# Altium project FLEXI_HAL_Quark_Mezz.PrjPCB
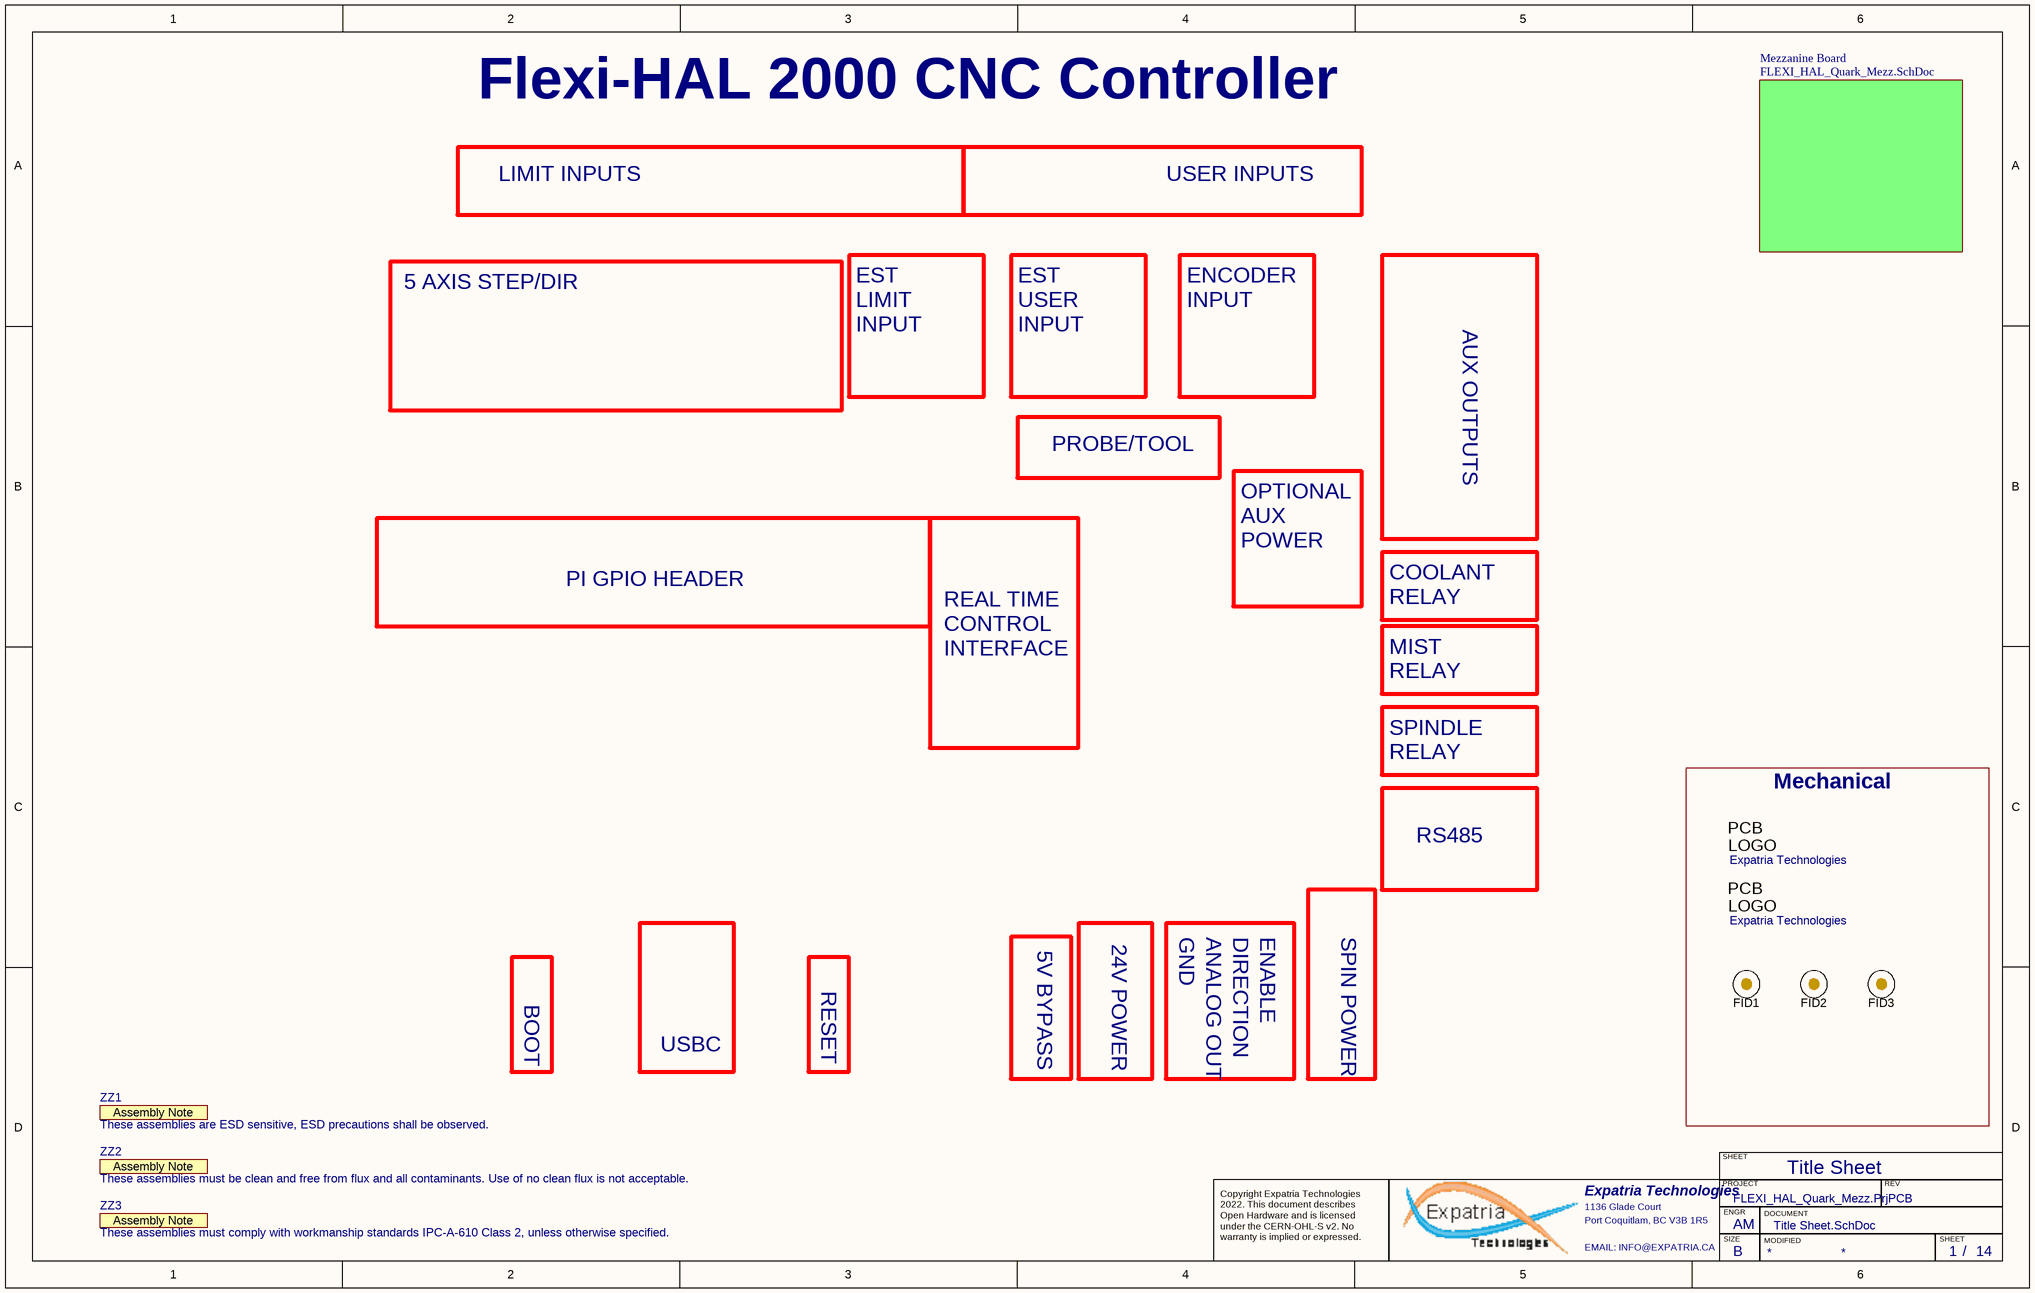
[diagram p0: Title Sheet.SchDoc]
PCBPARTNO: FlexiHAL-STP; PCBREVNO: A1; Title: FlexiHAL-STP; VarRevNo: A1
9 sheets, 138 parts. Net scope: hierarchical (ports join the sheet entries above them; power ports are global).
Board file: FLEXI_HAL_Quark_Mezz.pcbdoc
Sheets:
  Title Sheet.SchDoc
    Mezzanine Board = FLEXI_HAL_Quark_Mezz.SchDoc
      LIM_SW = Limit_Switches.SchDoc
        XL = Photocoupler12Vinput.SchDoc
        YL = Photocoupler12Vinput.SchDoc
        ZL = Photocoupler12Vinput.SchDoc
        AL = Photocoupler12Vinput.SchDoc
        BL = Photocoupler12Vinput.SchDoc
        CL = Photocoupler12Vinput.SchDoc
      USR_SW = Misc_switches.SchDoc
        UD = Photocoupler12Vinput.SchDoc
        UP = Photocoupler12Vinput.SchDoc
        UR = Photocoupler12Vinput.SchDoc
        UH = Photocoupler12Vinput.SchDoc
        UT = Photocoupler12Vinput.SchDoc
      SPINDLE = Spindle_Control.SchDoc
      AUX_O = Aux_Outputs.SchDoc
        RL = Relay_Driver.SchDoc
        RL = Relay_Driver.SchDoc
        RL = Relay_Driver.SchDoc
        RL = Relay_Driver.SchDoc
        RL = Relay_Driver.SchDoc
        RL = Relay_Driver.SchDoc
      AUX_I = Aux_Inputs.SchDoc

## Sheet Title Sheet.SchDoc: STM32F446 CNC
size B; Author: AM; CompanyName: Expatria Technologies; DrawnBy: A.Marles; Engineer: AM; Organization: Expatria Technolgoies; DocumentNumber: 1; Revision: A1; SheetNumber: 1; SheetTotal: 14

### Parts
FID1  Fiducial  [Fiducial10-20]  (value not drawn)  (no BOM)
FID2  Fiducial  [Fiducial10-20]  (value not drawn)  (no BOM)
FID3  Fiducial  [Fiducial10-20]  (value not drawn)  (no BOM)
Logo1  Expatria Technologies  [Expatria-Logo]  (no BOM)
Logo2  Expatria Technologies  [Expatria-Logo]  (no BOM)
ZZ1  These assemblies are ESD sensitive, ESD precautions shall be observed.  [AssemblyNote]  (graphical)
ZZ2  These assemblies must be clean and free from flux and all contaminants. Use of no clean flux is not acceptable.  [AssemblyNote]  (graphical)
ZZ3  These assemblies must comply with workmanship standards IPC-A-610 Class 2, unless otherwise specified.  [AssemblyNote]  (graphical)

### Blocks framed on the sheet
Mechanical: FID1-FID3 Logo1 Logo2

### Sub-sheets
Mezzanine Board = FLEXI_HAL_Quark_Mezz.SchDoc: no entries

### Notes on the sheet
- Flexi-HAL 2000 CNC Controller
- LIMIT INPUTS
- USER INPUTS
- 5 AXIS STEP/DIR
- EST
  LIMIT
  INPUT
- EST
  USER
  INPUT
- ENCODER
  INPUT
- AUX OUTPUTS
- PROBE/TOOL
- OPTIONAL
  AUX
  POWER
- PI GPIO HEADER
- COOLANT
  RELAY
- MIST
  RELAY
- SPINDLE
  RELAY
- REAL TIME CONTROL INTERFACE
- RS485
- 5V BYPASS
- 24V POWER
- GND
- ANALOG OUT
- DIRECTION
- ENABLE
- SPIN POWER
- BOOT
- RESET
- USBC
- Title Sheet
- SHEET
- Expatria Technologies
- 1136 Glade Court
- Port Coquitlam, BC V3B 1R5
- PROJECT
- SIZE
- ENGR
- MODIFIED
- DOCUMENT
- REV
- Copyright Expatria Technologies 2022. This document describes Open Hardware and is licensed under the CERN-OHL-S v2. No warranty is implied or expressed.
- EMAIL: INFO@EXPATRIA.CA
- B
- /
- (in symbol AssemblyNote) Assembly Note
- (in symbol SBT-Logo) PCB; LOGO

### Library data of the parts
FID1-FID3 = Fiducial: FIDUCIAL NO ASSEMBLY; Manufacturer 1: NONE; Manufacturer Part Number 1: NONE; Value: Fiducial
Logo1 Logo2 = SBT-Logo: Manufacturer 1: NONE; Value: Expatria Logo; Manufacturer Part Number 1: NONE
ZZ1-ZZ3 = AssemblyNote: SymbolCreator: codlsc; SymbolVersion: 2010-05-18; CompType: AssemblyNote; ClassName: AssemblyNote; Publisher: Texas Instruments; LatestRevisionDate: 2012-06-14; LatestRevisionNote: Initial Version; Alternate Manufacturer: -; Alternate PartNumber: -; Parameter 1: *

## Sheet FLEXI_HAL_Quark_Mezz.SchDoc: RP2040 CNC
size C; Author: AM; CompanyName: Expatria Technologies; DrawnBy: A.Marles; Engineer: AM; Organization: Expatria Technolgoies; Address1: Schematic; DocumentNumber: 2; Revision: A1; SheetNumber: 2; SheetTotal: 14
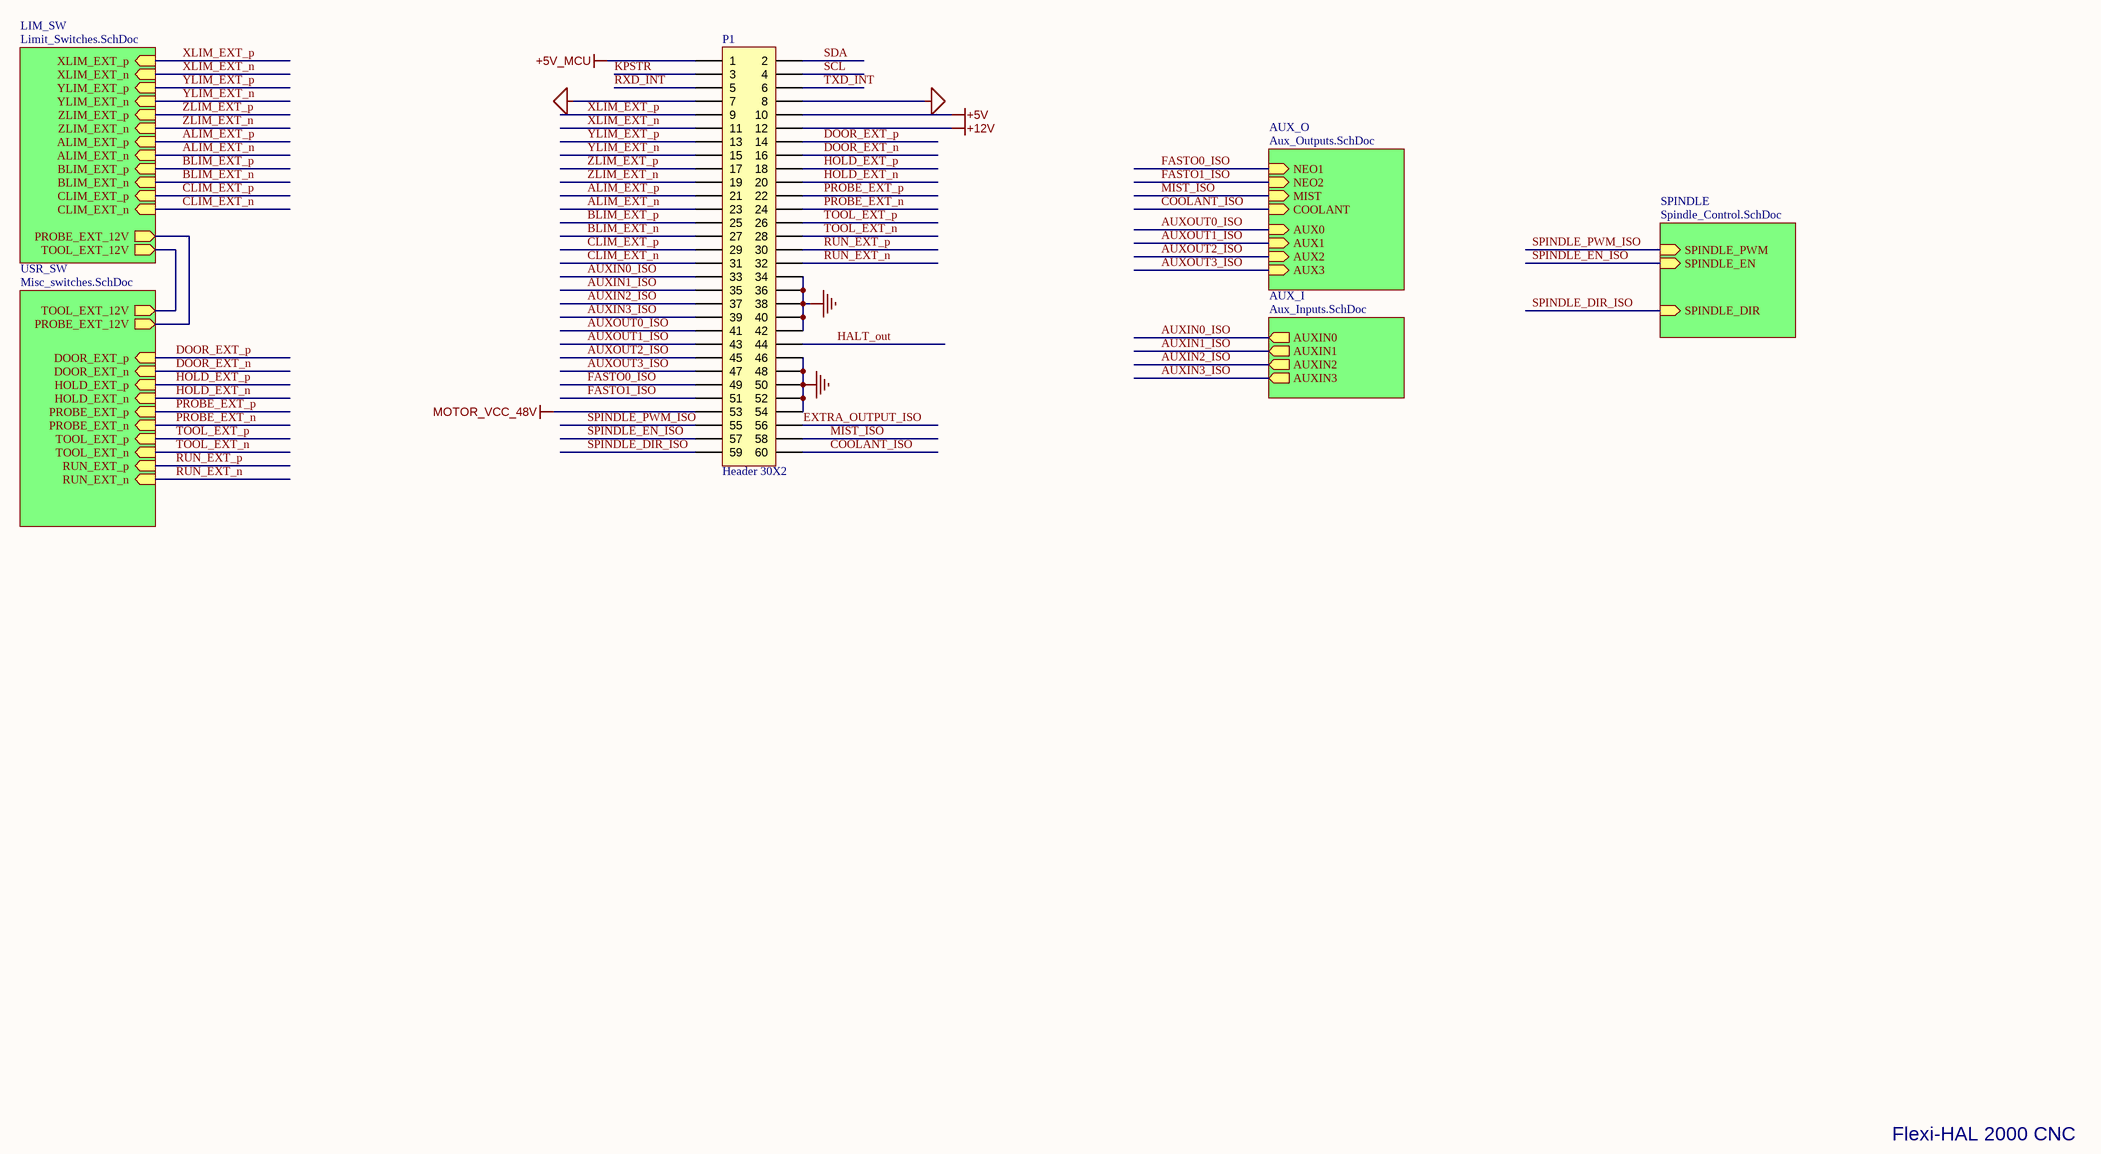
[diagram p1: FLEXI_HAL_Quark_Mezz.SchDoc]

### Parts
P1  Header 30X2  [Flexi-Quark-Mezzanine - BOTTOM]

### Sub-sheets
AUX_I = Aux_Inputs.SchDoc: AUXIN3 (out), AUXIN0 (out), AUXIN1 (out), AUXIN2 (out)
AUX_O = Aux_Outputs.SchDoc: AUX3 (in), AUX0 (in), AUX1 (in), AUX2 (in), COOLANT (in), MIST (in), NEO2 (in), NEO1 (in)
LIM_SW = Limit_Switches.SchDoc: PROBE_EXT_12V (out), TOOL_EXT_12V (out), CLIM_EXT_n (in), BLIM_EXT_n (in), ALIM_EXT_n (in), BLIM_EXT_p (in), CLIM_EXT_p (in), ALIM_EXT_p (in), ZLIM_EXT_p (in), XLIM_EXT_n (in), XLIM_EXT_p (in), ZLIM_EXT_n (in), YLIM_EXT_n (in), YLIM_EXT_p (in)
SPINDLE = Spindle_Control.SchDoc: SPINDLE_EN (in), SPINDLE_DIR (in), SPINDLE_PWM (in)
USR_SW = Misc_switches.SchDoc: PROBE_EXT_n (in), RUN_EXT_p (in), PROBE_EXT_p (in), DOOR_EXT_n (in), TOOL_EXT_n (in), TOOL_EXT_p (in), HOLD_EXT_n (in), RUN_EXT_n (in), HOLD_EXT_p (in), DOOR_EXT_p (in), TOOL_EXT_12V (out), PROBE_EXT_12V (out)

### Nets
+5V: P1.10
+5V_MCU: P1.1
+12V: P1.9 P1.12 P1.13 P1.14 P1.17 P1.18 P1.21 P1.22 P1.25 P1.26 P1.29 P1.30 ; sheet LIM_SW/BLIM_EXT_p, sheet LIM_SW/CLIM_EXT_p, sheet LIM_SW/ALIM_EXT_p, sheet LIM_SW/ZLIM_EXT_p, sheet LIM_SW/XLIM_EXT_p, sheet LIM_SW/YLIM_EXT_p, sheet USR_SW/RUN_EXT_p, sheet USR_SW/PROBE_EXT_p, sheet USR_SW/TOOL_EXT_p, sheet USR_SW/HOLD_EXT_p, sheet USR_SW/DOOR_EXT_p  [also labelled ALIM_EXT_p, BLIM_EXT_p, CLIM_EXT_p, DOOR_EXT_p, HOLD_EXT_p, PROBE_EXT_p, RUN_EXT_p, TOOL_EXT_p, XLIM_EXT_p, YLIM_EXT_p, ZLIM_EXT_p]
GND: P1.34 P1.36 P1.38 P1.40 P1.42 P1.46 P1.48 P1.50 P1.52 P1.54
MCU_GND: P1.7 P1.8
MOTOR_VCC_48V: P1.53
ALIM_EXT_n: P1.23 ; sheet LIM_SW/ALIM_EXT_n
AUXIN0_ISO: P1.33 ; sheet AUX_I/AUXIN0
AUXIN1_ISO: P1.35 ; sheet AUX_I/AUXIN1
AUXIN2_ISO: P1.37 ; sheet AUX_I/AUXIN2
AUXIN3_ISO: P1.39 ; sheet AUX_I/AUXIN3
AUXOUT0_ISO: P1.41 ; sheet AUX_O/AUX0
AUXOUT1_ISO: P1.43 ; sheet AUX_O/AUX1
AUXOUT2_ISO: P1.45 ; sheet AUX_O/AUX2
AUXOUT3_ISO: P1.47 ; sheet AUX_O/AUX3
BLIM_EXT_n: P1.27 ; sheet LIM_SW/BLIM_EXT_n
CLIM_EXT_n: P1.31 ; sheet LIM_SW/CLIM_EXT_n
COOLANT_ISO: P1.60 ; sheet AUX_O/COOLANT
DOOR_EXT_n: P1.16 ; sheet USR_SW/DOOR_EXT_n
EXTRA_OUTPUT_ISO: P1.56
FASTO0_ISO: P1.49 ; sheet AUX_O/NEO1
FASTO1_ISO: P1.51 ; sheet AUX_O/NEO2
HALT_out: P1.44
HOLD_EXT_n: P1.20 ; sheet USR_SW/HOLD_EXT_n
KPSTR: P1.3
MIST_ISO: P1.58 ; sheet AUX_O/MIST
PROBE_EXT_n: P1.24 ; sheet LIM_SW/PROBE_EXT_12V, sheet USR_SW/PROBE_EXT_n, sheet USR_SW/PROBE_EXT_12V
RUN_EXT_n: P1.32 ; sheet USR_SW/RUN_EXT_n
RXD_INT: P1.5
SCL: P1.4
SDA: P1.2
SPINDLE_DIR_ISO: P1.59 ; sheet SPINDLE/SPINDLE_DIR
SPINDLE_EN_ISO: P1.57 ; sheet SPINDLE/SPINDLE_EN
SPINDLE_PWM_ISO: P1.55 ; sheet SPINDLE/SPINDLE_PWM
TOOL_EXT_n: P1.28 ; sheet LIM_SW/TOOL_EXT_12V, sheet USR_SW/TOOL_EXT_n, sheet USR_SW/TOOL_EXT_12V
TXD_INT: P1.6
XLIM_EXT_n: P1.11 ; sheet LIM_SW/XLIM_EXT_n
YLIM_EXT_n: P1.15 ; sheet LIM_SW/YLIM_EXT_n
ZLIM_EXT_n: P1.19 ; sheet LIM_SW/ZLIM_EXT_n

### Notes on the sheet
- Flexi-HAL 2000 CNC
- Expatria Technologies
- SHEET
- PROJECT
- REV
- 1136 Glade Court
- Port Coquitlam, BC V3B 1R5
- EMAIL: INFO@EXPATRIA.CA
- SIZE
- ENGR
- C
- MODIFIED
- DOCUMENT
- /
- Copyright Expatria Technologies 2022. This document describes Open Hardware and is licensed under the CERN-OHL-S v2. No warranty is implied or expressed.

### Library data of the parts
P1 = Header 30X2: Header, 30-Pin, Dual row; LatestRevisionDate: 17-Jul-2002; LatestRevisionNote: Re-released for DXP Platform.; Publisher: Altium Limited

## Sheet Limit_Switches.SchDoc: RP2040 CNC
size B; Author: AM; CompanyName: Expatria Technologies; DrawnBy: A.Marles; Engineer: AM; Organization: Expatria Technolgoies; DocumentNumber: 7; Revision: A1; SheetNumber: 7; SheetTotal: 14
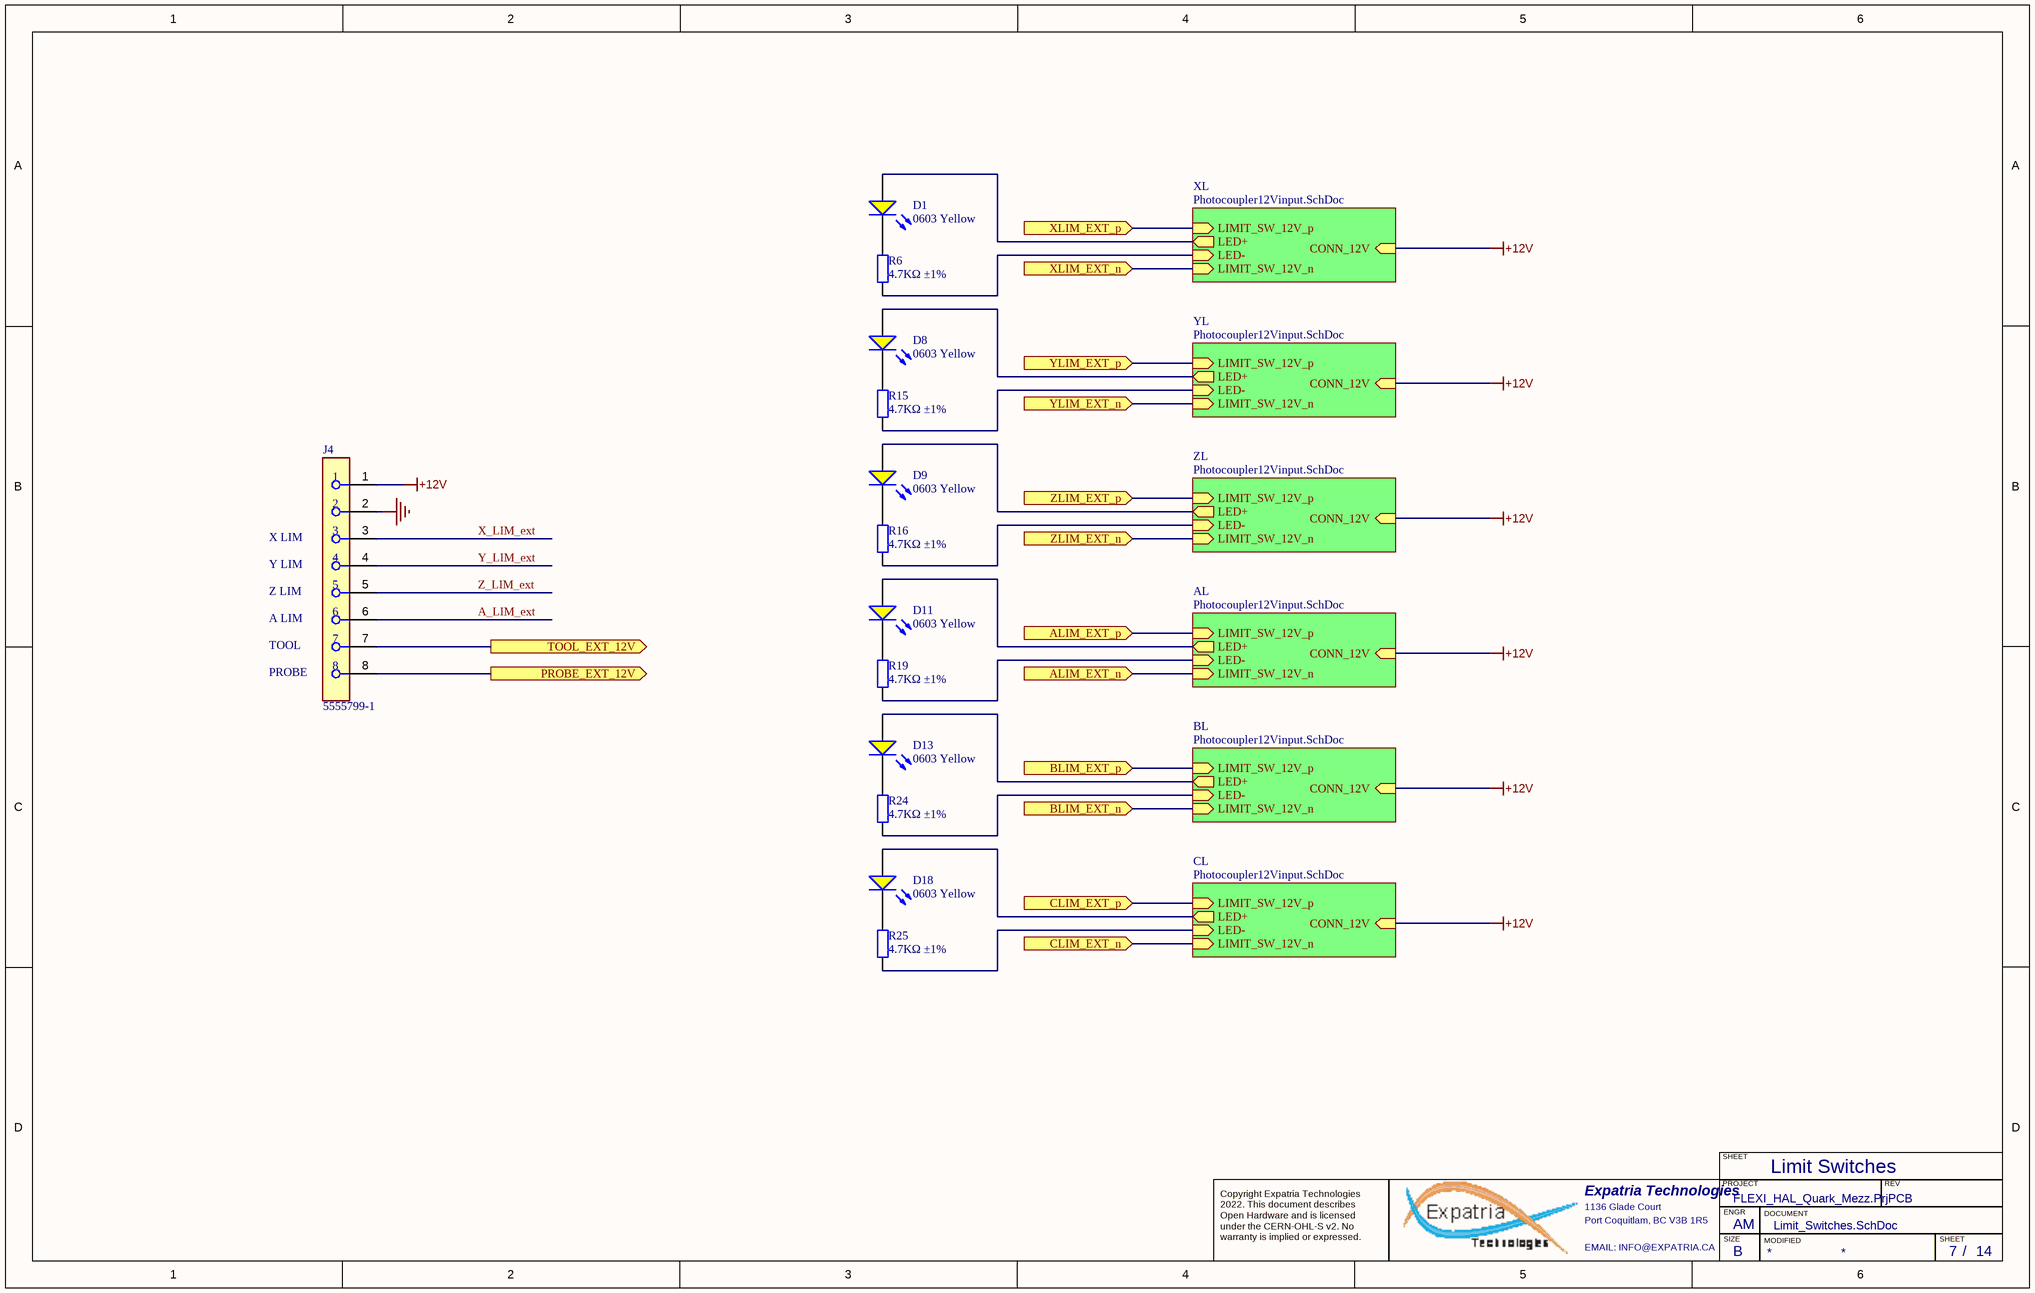
[diagram p2: Limit_Switches.SchDoc]

### Parts
D1  0603 Yellow  [0603_LED_S1]
D8  0603 Yellow  [0603_LED_S1]
D9  0603 Yellow  [0603_LED_S1]
D11  0603 Yellow  [0603_LED_S1]
D13  0603 Yellow  [0603_LED_S1]
D18  0603 Yellow  [0603_LED_S1]
J4  5555799-1  [FP-5555799-1-MFG]
R6  4.7KΩ ±1%  [0603_R]
R15  4.7KΩ ±1%  [0603_R]
R16  4.7KΩ ±1%  [0603_R]
R19  4.7KΩ ±1%  [0603_R]
R24  4.7KΩ ±1%  [0603_R]
R25  4.7KΩ ±1%  [0603_R]

### Sub-sheets
AL = Photocoupler12Vinput.SchDoc: LED+ (out), LED- (in), LIMIT_SW_12V_n (in), LIMIT_SW_12V_p (in), CONN_12V (in)
BL = Photocoupler12Vinput.SchDoc: LED+ (out), LED- (in), LIMIT_SW_12V_n (in), LIMIT_SW_12V_p (in), CONN_12V (in)
CL = Photocoupler12Vinput.SchDoc: LED+ (out), LED- (in), LIMIT_SW_12V_n (in), LIMIT_SW_12V_p (in), CONN_12V (in)
XL = Photocoupler12Vinput.SchDoc: LED+ (out), LED- (in), LIMIT_SW_12V_n (in), LIMIT_SW_12V_p (in), CONN_12V (in)
YL = Photocoupler12Vinput.SchDoc: LED+ (out), LED- (in), LIMIT_SW_12V_n (in), LIMIT_SW_12V_p (in), CONN_12V (in)
ZL = Photocoupler12Vinput.SchDoc: LED+ (out), LED- (in), LIMIT_SW_12V_n (in), LIMIT_SW_12V_p (in), CONN_12V (in)

### Ports
ALIM_EXT_n (in), ALIM_EXT_p (in), BLIM_EXT_n (in), BLIM_EXT_p (in), CLIM_EXT_n (in), CLIM_EXT_p (in), PROBE_EXT_12V (out), TOOL_EXT_12V (out), XLIM_EXT_n (in), XLIM_EXT_p (in), YLIM_EXT_n (in), YLIM_EXT_p (in), ZLIM_EXT_n (in), ZLIM_EXT_p (in)

### Nets
+12V: D1.A D8.A D9.A D11.A D13.A D18.A J4.1 ; port XLIM_EXT_p, port YLIM_EXT_p, port ZLIM_EXT_p, port ALIM_EXT_p, port BLIM_EXT_p, port CLIM_EXT_p, sheet XL/LED+, sheet XL/LIMIT_SW_12V_p, sheet XL/CONN_12V, sheet YL/LED+, sheet YL/LIMIT_SW_12V_p, sheet YL/CONN_12V, sheet ZL/LED+, sheet ZL/LIMIT_SW_12V_p, sheet ZL/CONN_12V, sheet AL/LED+, sheet AL/LIMIT_SW_12V_p, sheet AL/CONN_12V, sheet BL/LED+, sheet BL/LIMIT_SW_12V_p, sheet BL/CONN_12V, sheet CL/LED+, sheet CL/LIMIT_SW_12V_p, sheet CL/CONN_12V
GND: J4.2
A_LIM_ext: J4.6
ALIM_EXT_n: R19.2 ; port ALIM_EXT_n, sheet AL/LED-, sheet AL/LIMIT_SW_12V_n
BLIM_EXT_n: R24.2 ; port BLIM_EXT_n, sheet BL/LED-, sheet BL/LIMIT_SW_12V_n
CLIM_EXT_n: R25.2 ; port CLIM_EXT_n, sheet CL/LED-, sheet CL/LIMIT_SW_12V_n
PROBE_EXT_n: J4.8 ; port PROBE_EXT_12V
TOOL_EXT_n: J4.7 ; port TOOL_EXT_12V
X_LIM_ext: J4.3
XLIM_EXT_n: R6.2 ; port XLIM_EXT_n, sheet XL/LED-, sheet XL/LIMIT_SW_12V_n
Y_LIM_ext: J4.4
YLIM_EXT_n: R15.2 ; port YLIM_EXT_n, sheet YL/LED-, sheet YL/LIMIT_SW_12V_n
Z_LIM_ext: J4.5
ZLIM_EXT_n: R16.2 ; port ZLIM_EXT_n, sheet ZL/LED-, sheet ZL/LIMIT_SW_12V_n
NetD1_K: D1.K R6.1
NetD8_K: D8.K R15.1
NetD9_K: D9.K R16.1
NetD11_K: D11.K R19.1
NetD13_K: D13.K R24.1
NetD18_K: D18.K R25.1

### Notes on the sheet
- (near J4) X LIM
- (near J4) Y LIM
- (near J4) Z LIM
- (near J4) A LIM
- TOOL
- (near J4) PROBE
- Limit Switches
- SHEET
- Expatria Technologies
- 1136 Glade Court
- Port Coquitlam, BC V3B 1R5
- PROJECT
- SIZE
- ENGR
- MODIFIED
- DOCUMENT
- REV
- Copyright Expatria Technologies 2022. This document describes Open Hardware and is licensed under the CERN-OHL-S v2. No warranty is implied or expressed.
- EMAIL: INFO@EXPATRIA.CA
- B
- /

### Library data of the parts
D1 D8 D9 D11 D13 D18 = 0603 LED Yellow: LED; ComponentLink1Description: 供应商链接; ComponentLink1URL: http://www.szlcsc.com/product/details_73147.html; Package: 0603; Supplier: LC; SuppliersPartNumber: C72038; Color: Yellow
J4 = CMP-03371-000003-1: CONN MOD JACK 8P8C VERT UNSHLD; Manufacturer: TE Connectivity; Pitch: 2.54mm; Number Of Contacts: 8; Is Female: yes; Device Class L3: unset; Manufacturer Part Number: 5555799-1; Temperature Range High: +85°C; Temperature Range Low: -40°C; Octopart: https://octopart.com/5555799-1-te+connectivity-39526335; Device Class L1: Connectors; Device Class L2: Modular / Ethernet Connectors; Mouser Description: Conn RJ-45 F 8 POS 2.54mm Solder ST Thru-Hole 8 Terminal 1 Port Cat 3 Box/Package/Tray; Digikey Description: CONN MOD JACK 8P8C VERT UNSHLD; Package: 5555799-1; Temperature: -40°C to +85°C; SuppliersPartNumber: C305983
R6 R15 R16 R19 R24 R25 = 0603 4.7K (4701) 1%: Chip resistor; Manufacturer: Uniroyal Elec; PartNumber: 0603WAF4701T5E; Power: 1/10W; ComponentLink1Description: Supplier link; ComponentLink1URL: http://www.szlcsc.com/product/details_23889.html; Package: 0603; Supplier: LC; SuppliersPartNumber: C23162; Resistance: 4.7KΩ; Tolerance: 1%

## Sheet Photocoupler12Vinput.SchDoc: STM32F446 CNC
size B; Author: AM; CompanyName: Expatria Technologies; DrawnBy: A.Marles; Engineer: AM; Organization: Expatria Technolgoies; DocumentNumber: 14; Revision: A1; SheetNumber: 14; SheetTotal: 14
Used 11 times, as channels Mezzanine Board/LIM_SW/XL, Mezzanine Board/LIM_SW/YL, Mezzanine Board/LIM_SW/ZL, Mezzanine Board/LIM_SW/AL, Mezzanine Board/LIM_SW/BL, Mezzanine Board/LIM_SW/CL, Mezzanine Board/USR_SW/UD, Mezzanine Board/USR_SW/UP, Mezzanine Board/USR_SW/UR, Mezzanine Board/USR_SW/UH, Mezzanine Board/USR_SW/UT. Parts and nets are listed once, with the designators drawn on the sheet.
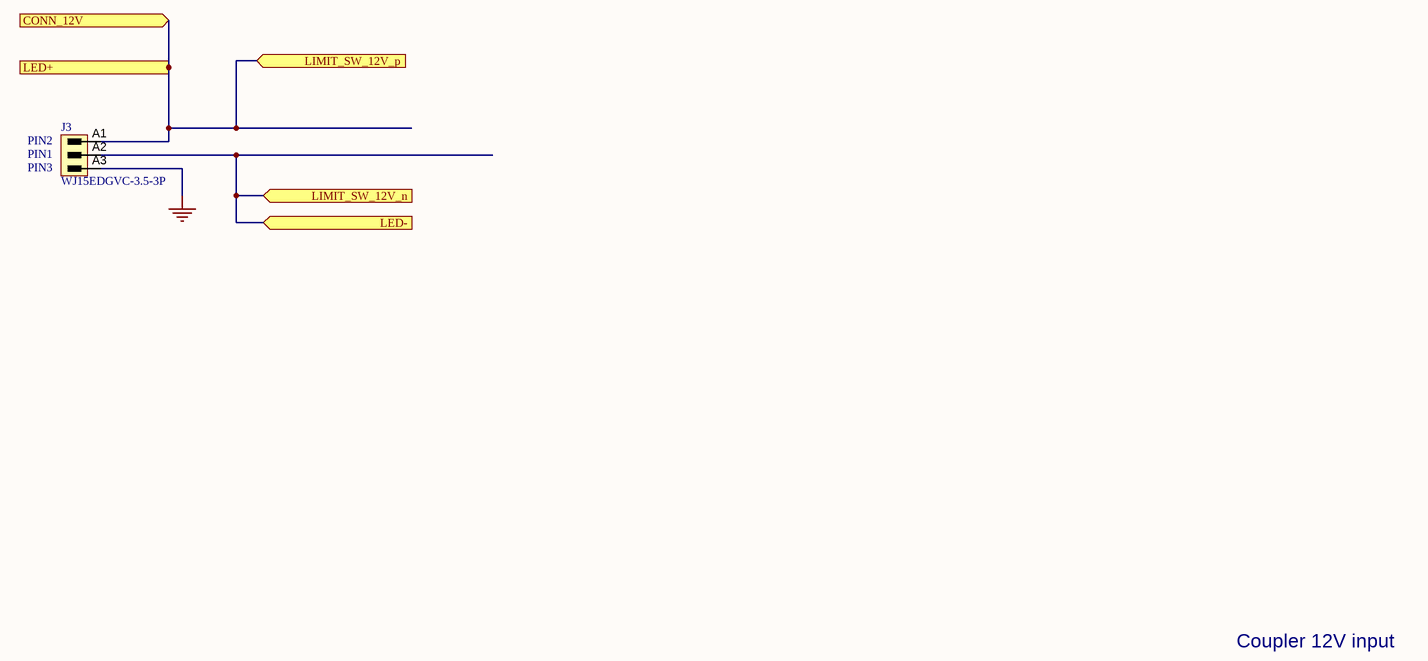
[diagram p3: Photocoupler12Vinput.SchDoc]

### Parts
J3  WJ15EDGVC-3.5-3P  [691321100003 - 3.5mm  3p]

### Ports
CONN_12V (in), LED+ (out), LED- (in), LIMIT_SW_12V_n (in), LIMIT_SW_12V_p (in)

### Nets
GND: J3.A3
CONN_12V: J3.A1 ; port LED+, port CONN_12V, port LIMIT_SW_12V_p
LED-: J3.A2 ; port LED-, port LIMIT_SW_12V_n

### Channels
Mezzanine Board/LIM_SW/XL: designators end in _XL; ports CONN_12V=+12V LED+=+12V LED-=XLIM_EXT_n LIMIT_SW_12V_n=XLIM_EXT_n LIMIT_SW_12V_p=+12V
Mezzanine Board/LIM_SW/YL: designators end in _YL; ports CONN_12V=+12V LED+=+12V LED-=YLIM_EXT_n LIMIT_SW_12V_n=YLIM_EXT_n LIMIT_SW_12V_p=+12V
Mezzanine Board/LIM_SW/ZL: designators end in _ZL; ports CONN_12V=+12V LED+=+12V LED-=ZLIM_EXT_n LIMIT_SW_12V_n=ZLIM_EXT_n LIMIT_SW_12V_p=+12V
Mezzanine Board/LIM_SW/AL: designators end in _AL; ports CONN_12V=+12V LED+=+12V LED-=ALIM_EXT_n LIMIT_SW_12V_n=ALIM_EXT_n LIMIT_SW_12V_p=+12V
Mezzanine Board/LIM_SW/BL: designators end in _BL; ports CONN_12V=+12V LED+=+12V LED-=BLIM_EXT_n LIMIT_SW_12V_n=BLIM_EXT_n LIMIT_SW_12V_p=+12V
Mezzanine Board/LIM_SW/CL: designators end in _CL; ports CONN_12V=+12V LED+=+12V LED-=CLIM_EXT_n LIMIT_SW_12V_n=CLIM_EXT_n LIMIT_SW_12V_p=+12V
Mezzanine Board/USR_SW/UD: designators end in _UD; ports CONN_12V=+12V LED+=+12V LED-=DOOR_EXT_n LIMIT_SW_12V_n=DOOR_EXT_n LIMIT_SW_12V_p=+12V
Mezzanine Board/USR_SW/UP: designators end in _UP; ports CONN_12V=+12V LED+=+12V LED-=PROBE_EXT_n LIMIT_SW_12V_n=PROBE_EXT_n LIMIT_SW_12V_p=+12V
Mezzanine Board/USR_SW/UR: designators end in _UR; ports CONN_12V=+12V LED+=+12V LED-=RUN_EXT_n LIMIT_SW_12V_n=RUN_EXT_n LIMIT_SW_12V_p=+12V
Mezzanine Board/USR_SW/UH: designators end in _UH; ports CONN_12V=+12V LED+=+12V LED-=HOLD_EXT_n LIMIT_SW_12V_n=HOLD_EXT_n LIMIT_SW_12V_p=+12V
Mezzanine Board/USR_SW/UT: designators end in _UT; ports CONN_12V=+12V LED+=+12V LED-=TOOL_EXT_n LIMIT_SW_12V_n=TOOL_EXT_n LIMIT_SW_12V_p=+12V

### Notes on the sheet
- (near J3) PIN2
- (near J3) PIN1
- (near J3) PIN3
- Coupler 12V input
- SHEET
- Expatria Technologies
- 1136 Glade Court
- Port Coquitlam, BC V3B 1R5
- PROJECT
- SIZE
- ENGR
- MODIFIED
- DOCUMENT
- REV
- Copyright Expatria Technologies 2022. This document describes Open Hardware and is licensed under the CERN-OHL-S v2. No warranty is implied or expressed.
- EMAIL: INFO@EXPATRIA.CA
- B
- /

### Library data of the parts
J3 = 3.5mm Terminal Header 3p: Header,Male Pin,Covered(4 Sided) 3 1 0.138"（3.50mm） 3 P=3.5mm Pluggable System Terminal Block RoHS; Manufacturer: Ningbo Kangnex Elec; Pitch_mm: 3.5 mm; UL_94_flammability_rating: V-0; Side_termination_characteristic: closed side; Solder_pin_length_mm: 3.2 mm; Short_text_for_material: SL 3.50/03/180G 3.2SN OR BX; Pitch_inch: 0.138 inch; PartNumber: WJ15EDGVC-3.5-3P; PackageReference: SL_3_50_180G_03; ComponentLink1URL: http://www.weidmueller.com/; ComponentLink1Description: Manufacturer URL; Packaging: Box; Revision: V1; SuppliersPartNumber: C192778; Manufacturer 1: Ningbo Kangnex Elec; Manufacturer Part Number 1: WJ15EDGVC-3.5-3P; Package: P=3.5mm

## Sheet Misc_switches.SchDoc: RP2040 CNC
size B; Author: AM; CompanyName: Expatria Technologies; DrawnBy: A.Marles; Engineer: AM; Organization: Expatria Technolgoies; DocumentNumber: 8; Revision: A1; SheetNumber: 8; SheetTotal: 14
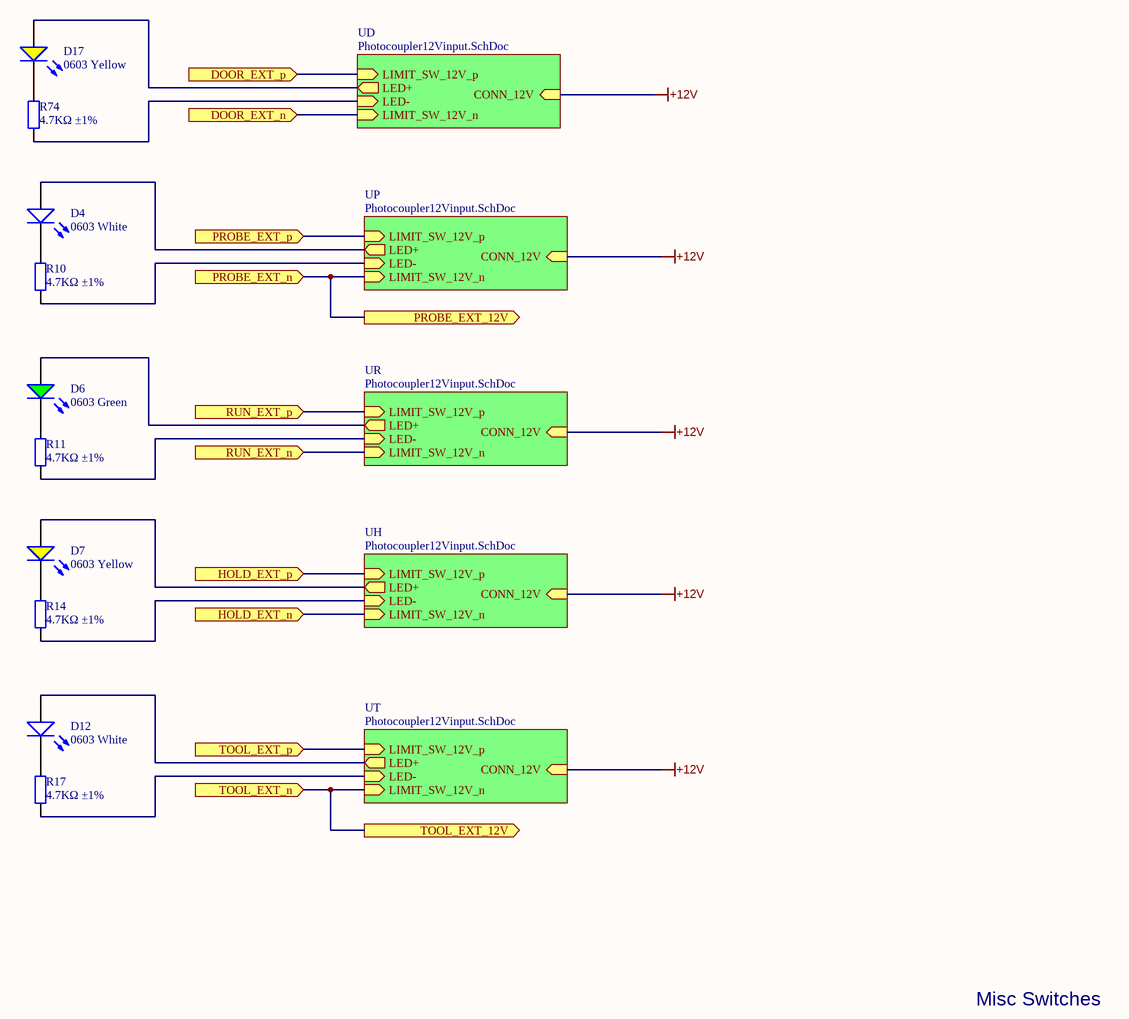
[diagram p4: Misc_switches.SchDoc]

### Parts
D4  0603 White  [0603_LED_S1]
D6  0603 Green  [0603_LED_S1]
D7  0603 Yellow  [0603_LED_S1]
D12  0603 White  [0603_LED_S1]
D17  0603 Yellow  [0603_LED_S1]
R10  4.7KΩ ±1%  [0603_R]
R11  4.7KΩ ±1%  [0603_R]
R14  4.7KΩ ±1%  [0603_R]
R17  4.7KΩ ±1%  [0603_R]
R74  4.7KΩ ±1%  [0603_R]

### Sub-sheets
UD = Photocoupler12Vinput.SchDoc: LED+ (out), LED- (in), LIMIT_SW_12V_n (in), LIMIT_SW_12V_p (in), CONN_12V (in)
UH = Photocoupler12Vinput.SchDoc: LED+ (out), LED- (in), LIMIT_SW_12V_n (in), LIMIT_SW_12V_p (in), CONN_12V (in)
UP = Photocoupler12Vinput.SchDoc: LED+ (out), LED- (in), LIMIT_SW_12V_n (in), LIMIT_SW_12V_p (in), CONN_12V (in)
UR = Photocoupler12Vinput.SchDoc: LED+ (out), LED- (in), LIMIT_SW_12V_n (in), LIMIT_SW_12V_p (in), CONN_12V (in)
UT = Photocoupler12Vinput.SchDoc: LED+ (out), LED- (in), LIMIT_SW_12V_n (in), LIMIT_SW_12V_p (in), CONN_12V (in)

### Ports
DOOR_EXT_n (in), DOOR_EXT_p (in), HOLD_EXT_n (in), HOLD_EXT_p (in), PROBE_EXT_12V (out), PROBE_EXT_n (in), PROBE_EXT_p (in), RUN_EXT_n (in), RUN_EXT_p (in), TOOL_EXT_12V (out), TOOL_EXT_n (in), TOOL_EXT_p (in)

### Nets
+12V: D4.A D6.A D7.A D12.A D17.A ; port TOOL_EXT_p, port HOLD_EXT_p, port RUN_EXT_p, port PROBE_EXT_p, port DOOR_EXT_p, sheet UD/LED+, sheet UD/LIMIT_SW_12V_p, sheet UD/CONN_12V, sheet UP/LED+, sheet UP/LIMIT_SW_12V_p, sheet UP/CONN_12V, sheet UR/LED+, sheet UR/LIMIT_SW_12V_p, sheet UR/CONN_12V, sheet UH/LED+, sheet UH/LIMIT_SW_12V_p, sheet UH/CONN_12V, sheet UT/LED+, sheet UT/LIMIT_SW_12V_p, sheet UT/CONN_12V
DOOR_EXT_n: R74.2 ; port DOOR_EXT_n, sheet UD/LED-, sheet UD/LIMIT_SW_12V_n
HOLD_EXT_n: R14.2 ; port HOLD_EXT_n, sheet UH/LED-, sheet UH/LIMIT_SW_12V_n
PROBE_EXT_n: R10.2 ; port PROBE_EXT_n, port PROBE_EXT_12V, sheet UP/LED-, sheet UP/LIMIT_SW_12V_n
RUN_EXT_n: R11.2 ; port RUN_EXT_n, sheet UR/LED-, sheet UR/LIMIT_SW_12V_n
TOOL_EXT_n: R17.2 ; port TOOL_EXT_n, port TOOL_EXT_12V, sheet UT/LED-, sheet UT/LIMIT_SW_12V_n
NetD4_K: D4.K R10.1
NetD6_K: D6.K R11.1
NetD7_K: D7.K R14.1
NetD12_K: D12.K R17.1
NetD17_K: D17.K R74.1

### Notes on the sheet
- Misc Switches
- SHEET
- Expatria Technologies
- 1136 Glade Court
- Port Coquitlam, BC V3B 1R5
- PROJECT
- SIZE
- ENGR
- MODIFIED
- DOCUMENT
- REV
- Copyright Expatria Technologies 2022. This document describes Open Hardware and is licensed under the CERN-OHL-S v2. No warranty is implied or expressed.
- EMAIL: INFO@EXPATRIA.CA
- B
- /

### Library data of the parts
D4 D12 = 0603 LED White: LED; ComponentLink1Description: 供应商链接; ComponentLink1URL: http://www.szlcsc.com/product/details_2663.html; Package: 0603; Supplier: LC; SuppliersPartNumber: C2290; Color: White
D6 = 0603 LED Green: LED; ComponentLink1Description: 供应商链接; ComponentLink1URL: http://www.szlcsc.com/product/details_73152.html; Package: 0603; Supplier: LC; SuppliersPartNumber: C72043; Color: Green
D7 D17 = 0603 LED Yellow: LED; ComponentLink1Description: 供应商链接; ComponentLink1URL: http://www.szlcsc.com/product/details_73147.html; Package: 0603; Supplier: LC; SuppliersPartNumber: C72038; Color: Yellow
R10 R11 R14 R17 R74 = 0603 4.7K (4701) 1%: as R6 on sheet Limit_Switches; ComponentLink1Description: Supplier link; ComponentLink1URL: http://www.szlcsc.com/product/details_23889.html; Package: 0603; Supplier: LC; SuppliersPartNumber: C23162; Resistance: 4.7KΩ; Tolerance: 1%

## Sheet Spindle_Control.SchDoc: STM32F446 CNC
size B; Author: AM; CompanyName: Expatria Technologies; DrawnBy: A.Marles; Engineer: AM; Organization: Expatria Technolgoies; DocumentNumber: 5; Revision: A1; SheetNumber: 5; SheetTotal: 14
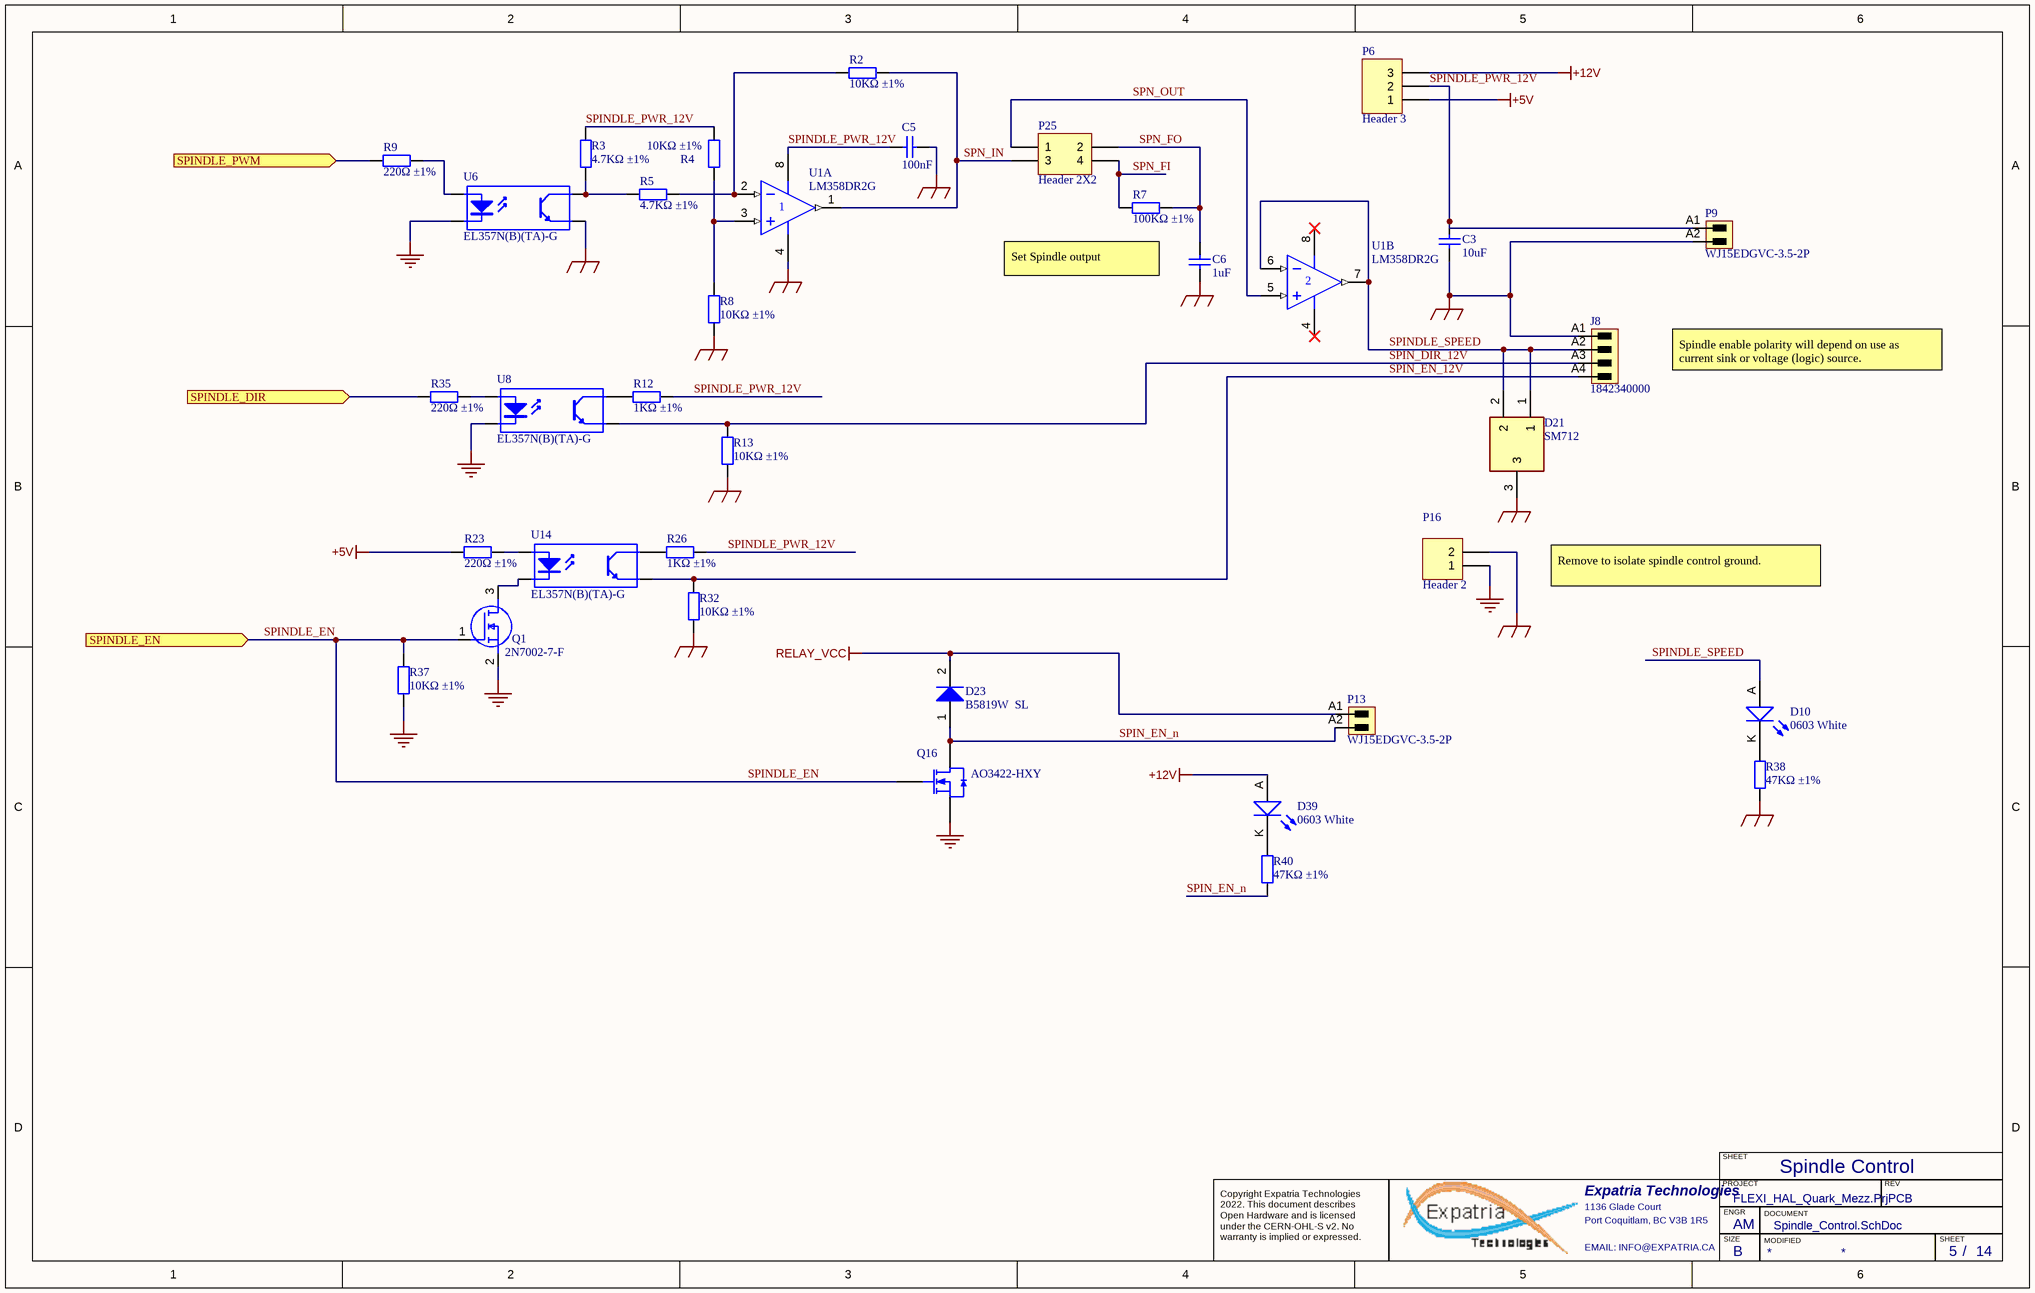
[diagram p5: Spindle_Control.SchDoc]

### Parts
C3  10uF  [1206_C]
C5  100nF  [0603_C]
C6  1uF  [0603_C]
D10  0603 White  [0603_LED_S1]
D21  SM712  [SOT95P230X117-3N]
D23  B5819W  SL  [SOD-123]
D39  0603 White  [0603_LED_S1]
J8  1842340000  [691321100004]
P6  Header 3  [HDR1X3]
P9  WJ15EDGVC-3.5-2P  [691321100002]
P13  WJ15EDGVC-3.5-2P  [691321100002]
P16  Header 2  [HDR1X2]
P25  Header 2X2  [HDR2X2]
Q1  2N7002-7-F  [SOT-23(SOT-23-3)]
Q16  AO3422-HXY  [SOT-23-3L]
R2  10KΩ ±1%  [0603_R]
R3  4.7KΩ ±1%  [0603_R]
R4  10KΩ ±1%  [0603_R]
R5  4.7KΩ ±1%  [0603_R]
R7  100KΩ ±1%  [0603_R]
R8  10KΩ ±1%  [0603_R]
R9  220Ω ±1%  [0402_R]
R12  1KΩ ±1%  [0603_R]
R13  10KΩ ±1%  [0603_R]
R23  220Ω ±1%  [0603_R]
R26  1KΩ ±1%  [0603_R]
R32  10KΩ ±1%  [0603_R]
R35  220Ω ±1%  [0603_R]
R37  10KΩ ±1%  [0603_R]
R38  47KΩ ±1%  [0603_R]
R40  47KΩ ±1%  [0603_R]
U1  LM358DR2G  [SOIC-8_150mil]  (parts A,B of 2)
U6  EL357N(B)(TA)-G  [SOP-4_P2.54]
U8  EL357N(B)(TA)-G  [SOP-4_P2.54]
U14  EL357N(B)(TA)-G  [SOP-4_P2.54]

### Ports
SPINDLE_DIR (in), SPINDLE_EN (in), SPINDLE_PWM (in)

### Nets
+5V: P6.1 R23.1
+12V: D39.A P6.3
GND: P16.1 Q1.2(S) Q16.2(S) R37.2 U6.2(K) U8.2(K)
RELAY_VCC: D23.2(K) P13.A1
SPIN_GND: C3.1 C5.1 C6.1 D21.3 J8.A1 P9.A2 P16.2 R8.2 R13.2 R32.2 R38.1 U1.4(V-) U6.3(E)
SPIN_DIR_12V: J8.A3 R13.1 U8.3(E)
SPIN_EN_12V: J8.A4 R32.1 U14.3(E)
SPIN_EN_n: D23.1(A) P13.A2 Q16.3(D) R40.1
SPINDLE_DIR_ISO: R35.1 ; port SPINDLE_DIR
SPINDLE_EN: Q1.1(G) Q16.1(G) R37.1 ; port SPINDLE_EN  [project net SPINDLE_EN_ISO]
SPINDLE_PWM_ISO: R9.1 ; port SPINDLE_PWM
SPINDLE_PWR_12V: C3.2 C5.2 P6.2 P9.A1 R3.1 R4.1 R12.1 R26.1 U1.8(V+)
SPINDLE_SPEED: D10.A D21.1 D21.2 J8.A2 U1.6(IN-) U1.7(OUT)
SPN_FI: P25.4 R7.2
SPN_FO: C6.2 P25.2 R7.1
SPN_IN: P25.3 R2.2 U1.1(OUT)
SPN_OUT: P25.1 U1.5(IN+)
NetD10_K: D10.K R38.2
NetD39_K: D39.K R40.2
NetQ1_3: Q1.3(D) U14.2(K)
NetR2_1: R2.1 R5.2 U1.2(IN-)
NetR3_2: R3.2 R5.1 U6.4(C)
NetR4_2: R4.2 R8.1 U1.3(IN+)
NetR9_2: R9.2 U6.1(A)
NetR12_2: R12.2 U8.4(C)
NetR23_2: R23.2 U14.1(A)
NetR26_2: R26.2 U14.4(C)
NetR35_2: R35.2 U8.1(A)

### Notes on the sheet
- Set Spindle output
- Spindle enable polarity will depend on use as current sink or voltage (logic) source.
- Remove to isolate spindle control ground.
- Spindle Control
- SHEET
- Expatria Technologies
- 1136 Glade Court
- Port Coquitlam, BC V3B 1R5
- PROJECT
- SIZE
- ENGR
- MODIFIED
- DOCUMENT
- REV
- Copyright Expatria Technologies 2022. This document describes Open Hardware and is licensed under the CERN-OHL-S v2. No warranty is implied or expressed.
- EMAIL: INFO@EXPATRIA.CA
- B
- /

### Library data of the parts
C3 = 1206 10uF (106) 10% 50V: Chip capacitors; Manufacturer: Samsung Electro-Mechanics; PartNumber: CL31A106KBHNNNE; Tolerance: 10%; Voltage: 50V; Package: 1206; Supplier: LC; SuppliersPartNumber: C13585; Capacitance: 10uF; Manufacturer 1: Samsung Electro-Mechanics
C5 = 0603 100nF (104) 10% 50V: Chip capacitors; Manufacturer: YAGEO; PartNumber: CC0603KRX7R9BB104; Tolerance: 10%; Voltage: 50V; Package: 0603; Supplier: LC; SuppliersPartNumber: C14663; Capacitance: 100nF; Manufacturer 1: YAGEO
C6 = 0603 1uF (105) 10% 50V: Chip capacitors; Manufacturer: Samsung Electro-Mechanics; PartNumber: CL10A105KB8NNNC; Tolerance: 10%; Voltage: 50V; Package: 0603; Supplier: LC; SuppliersPartNumber: C15849; Capacitance: 1uF; Manufacturer 1: Samsung Electro-Mechanics
D10 D39 = 0603 LED White: LED; ComponentLink1Description: 供应商链接; ComponentLink1URL: http://www.szlcsc.com/product/details_2663.html; Package: 0603; Supplier: LC; SuppliersPartNumber: C2290; Color: White
D21 = CDSOT23-SM712: Bidirectional 12V (Max), 7V (Max) 7.5V / 13.3V 10V / 20V 12A(8/20us) SOT-23-3 TVS RoHS; Manufacturer_Name: DOWO; Height: 1.17mm; Manufacturer_Part_Number: SM712; SuppliersPartNumber: C293966; Manufacturer 1: DOWO; Manufacturer Part Number 1: SM712; Package: SOT-23-3
D23 = SOD-123 B5819W  SL: Schottky Diode; ComponentLink1Description: 供应商链接; ComponentLink1URL: http://www.szlcsc.com/product/details_9093.html; Package: SOD-123; Supplier: LC; SuppliersPartNumber: C8598
J8 = 3.5mm Terminal Header 4p: OMNIMATE Signal - series BL/SL 3.50; Revision: V1; SuppliersPartNumber: C880556; ComponentLink1URL: http://www.weidmueller.com/; ComponentLink1Description: Manufacturer URL; Supplier: LCSC
P6 = Header 3: Header, 3-Pin; Publisher: Altium Limited; SuppliersPartNumber: C49257
P9 P13 = 3.5mm Terminal Header 2p: Header,Male Pin,Covered(4 Sided) 2 1 0.138"（3.50mm） 2 P=3.5mm Pluggable System Terminal Block RoHS; Manufacturer: Ningbo Kangnex Elec; UL_94_flammability_rating: V-0; Pitch_mm: 3.5 mm; Side_termination_characteristic: closed side; Pitch_inch: 0.138 inch; Solder_pin_length_mm: 3.2 mm; Short_text_for_material: SL 3.50/02/180G 3.2SN OR BX; PartNumber: WJ15EDGVC-3.5-2P; Revision: V1; PackageReference: SL_3_50_180G_02; Packaging: Box; SuppliersPartNumber: C192777; ComponentLink1Description: Manufacturer URL; ComponentLink1URL: http://www.weidmueller.com/; Manufacturer 1: Ningbo Kangnex Elec; Manufacturer Part Number 1: WJ15EDGVC-3.5-2P
P16 = Header 2: Header, 2-Pin; Publisher: Altium Limited; LatestRevisionDate: 17-Jul-2002; LatestRevisionNote: Re-released for DXP Platform.; SuppliersPartNumber: C234182
P25 = Header 2X2: Header, 2-Pin, Dual row; Supplier: LC; SuppliersPartNumber: C66690
Q1 = 2N7002-7-F: 60V 115mA 7.5Ω@5V,50mA 370mW N Channel SOT-23 MOSFETs ROHS; Manufacturer: Diodes Inc.; SuppliersPartNumber: C85049; Manufacturer Part Number: 2N7002-7-F; Value: 2N7002-7-F; Datasheet Link: https://datasheet.datasheetarchive.com/originals/distributors/SFDatasheet-0/sf-0003625.pdf; Height: 1.2mm; Manufacturer_Part_Number: 2N7002-7-F; Mouser Part Number: 621-2N7002-F; Mouser Price/Stock: https://www.mouser.co.uk/ProductDetail/Diodes-Incorporated/2N7002-7-F?qs=jMXWnm70%252BC%252BAX%252BMLzUkTZg%3D%3D; Arrow Part Number: 2N7002-7-F; Arrow Price/Stock: https://www.arrow.com/en/products/2n7002-7-f/diodes-incorporated?region=nac
Q16 = AO3400A N道沟 X0YV1T SOT-23: 60V 4.5A 8W 75mΩ@10V,5A 2.5V@250uA N Channel 695pF@15V SOT-23-3L MOSFETs ROHS; ComponentLink1Description: 供应商链接; ComponentLink1URL: http://www.szlcsc.com/product/details_21629.html; Package: SOT-23L; Supplier: LC; SuppliersPartNumber: C4748727
R2 R4 R8 R13 R32 R37 = 0603 10K (1002) 1%: Chip resistor; Manufacturer: Uniroyal Elec; PartNumber: 0603WAF1002T5E; Power: 1/10W; Package: 0603; Supplier: LC; SuppliersPartNumber: C25804; Resistance: 10KΩ; Tolerance: 1%; ComponentLink1Description: Supplier link; ComponentLink1URL: http://www.szlcsc.com/product/details_26547.html
R3 R5 = 0603 4.7K (4701) 1%: as R6 on sheet Limit_Switches; Package: 0603; Supplier: LC; SuppliersPartNumber: C23162; Resistance: 4.7KΩ; Tolerance: 1%; ComponentLink1Description: Supplier link; ComponentLink1URL: http://www.szlcsc.com/product/details_23889.html
R7 = 0603 100K (1003) 1%: Chip resistor; Manufacturer: Uniroyal Elec; PartNumber: 0603WAF1003T5E; Power: 1/10W; Package: 0603; Supplier: LC; SuppliersPartNumber: C25803; Resistance: 100KΩ; Tolerance: 1%; ComponentLink1Description: Supplier link; ComponentLink1URL: http://www.szlcsc.com/product/details_26546.html
R9 = 0402 220R (2200) 1%: Chip resistor; Manufacturer: Uniroyal Elec; PartNumber: 0402WGF2200TCE; Power: 1/16W; Package: 0402; Supplier: LC; SuppliersPartNumber: C25091; Resistance: 220Ω; Tolerance: 1%; ComponentLink1Description: Supplier link; ComponentLink1URL: http://www.szlcsc.com/product/details_25834.html
R12 R26 = 0603 1K (1001) 1%: Chip resistor; Manufacturer: Uniroyal Elec; PartNumber: 0603WAF1001T5E; Power: 1/10W; Package: 0603; Supplier: LC; SuppliersPartNumber: C21190; Resistance: 1KΩ; Tolerance: 1%; ComponentLink1Description: Supplier link; ComponentLink1URL: http://www.szlcsc.com/product/details_21904.html
R23 R35 = 0603 220R (2200) 1%: Chip resistor; Manufacturer: Uniroyal Elec; PartNumber: 0603WAF2200T5E; Power: 1/10W; ComponentLink1Description: Supplier link; ComponentLink1URL: http://www.szlcsc.com/product/details_23689.html; Package: 0603; Supplier: LC; SuppliersPartNumber: C22962; Resistance: 220Ω; Tolerance: 1%
R38 R40 = 0603 47K (4702) 1%: Chip resistor; Manufacturer: Uniroyal Elec; PartNumber: 0603WAF4702T5E; Power: 1/10W; ComponentLink1Description: Supplier link; ComponentLink1URL: http://www.szlcsc.com/product/details_26562.html; Package: 0603; Supplier: LC; SuppliersPartNumber: C25819; Resistance: 47KΩ; Tolerance: 1%
U1 = LM358DR2G_[C7950]: Dual Op Amp,  5 - 28 V,  8-PinSOIC; Manufacturer 1: ON Semiconductor; Package: SOIC-8; Supplier: LC; SuppliersPartNumber: C7950; Manufacturer Part Number 1: LM358DR2G; Packaging: Tape and Reel; Length: 5mm
U6 U8 U14 = EL357N(B)(TA)-G_[C6649]: OPTOISOLATOR 3.75KV TRANS 4-SOP; Manufacturer 1: Everlight Elec; Package: SOP-4_P2.54; Supplier: LC; SuppliersPartNumber: C6649; Manufacturer Part Number 1: EL357N(B)(TA)-G

## Sheet Aux_Outputs.SchDoc: RP2040 CNC
size B; Author: AM; CompanyName: Expatria Technologies; DrawnBy: A.Marles; Engineer: AM; Organization: Expatria Technolgoies; DocumentNumber: 10; Revision: A1; SheetNumber: 10; SheetTotal: 14
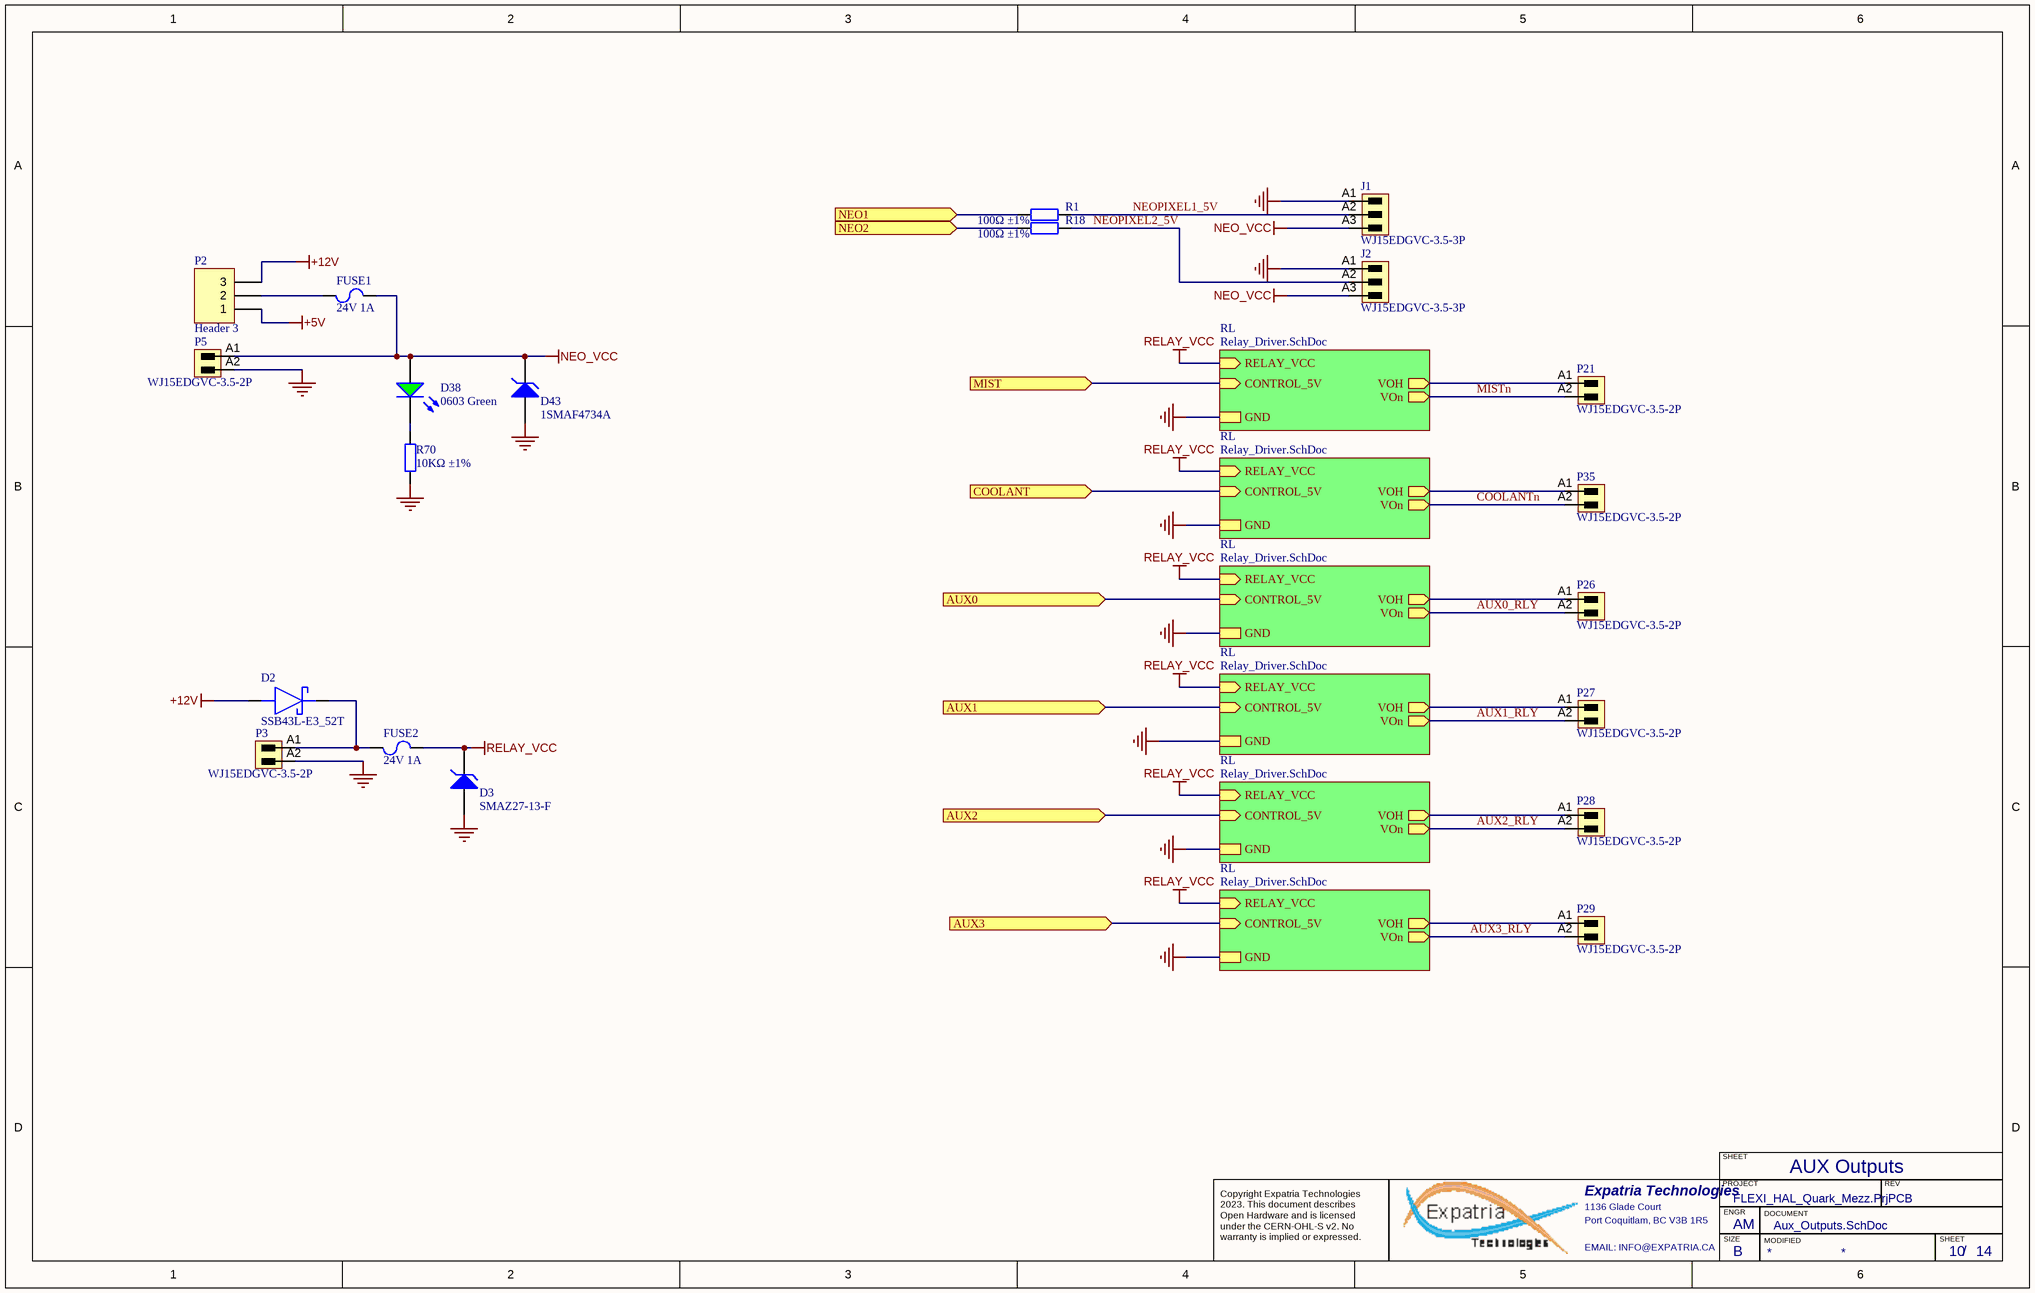
[diagram p6: Aux_Outputs.SchDoc]

### Parts
D2  SSB43L-E3_52T  [DIOM5436X244N]
D3  SMAZ27-13-F  [DIOM5226X240N]
D38  0603 Green  [0603_LED_S1]
D43  1SMAF4734A  [DIOM5226X240N]
FUSE1  24V 1A  [1206_C]
FUSE2  24V 1A  [1206_C]
J1  WJ15EDGVC-3.5-3P  [691321100003 - 3.5mm  3p]
J2  WJ15EDGVC-3.5-3P  [691321100003 - 3.5mm  3p]
P2  Header 3  [HDR1X3]
P3  WJ15EDGVC-3.5-2P  [691321100002]
P5  WJ15EDGVC-3.5-2P  [691321100002]
P21  WJ15EDGVC-3.5-2P  [691321100002]
P26  WJ15EDGVC-3.5-2P  [691321100002]
P27  WJ15EDGVC-3.5-2P  [691321100002]
P28  WJ15EDGVC-3.5-2P  [691321100002]
P29  WJ15EDGVC-3.5-2P  [691321100002]
P35  WJ15EDGVC-3.5-2P  [691321100002]
R1  100Ω ±1%  [0603_R]
R18  100Ω ±1%  [0603_R]
R70  10KΩ ±1%  [0603_R]

### Sub-sheets
RL = Relay_Driver.SchDoc: CONTROL_5V (in), VOn (out), VOH (out), RELAY_VCC (in), GND
RL = Relay_Driver.SchDoc: CONTROL_5V (in), VOn (out), VOH (out), RELAY_VCC (in), GND
RL = Relay_Driver.SchDoc: CONTROL_5V (in), VOn (out), VOH (out), RELAY_VCC (in), GND
RL = Relay_Driver.SchDoc: CONTROL_5V (in), VOn (out), VOH (out), RELAY_VCC (in), GND
RL = Relay_Driver.SchDoc: CONTROL_5V (in), VOn (out), VOH (out), RELAY_VCC (in), GND
RL = Relay_Driver.SchDoc: CONTROL_5V (in), VOn (out), VOH (out), RELAY_VCC (in), GND

### Ports
AUX0 (in), AUX1 (in), AUX2 (in), AUX3 (in), COOLANT (in), MIST (in), NEO1 (in), NEO2 (in)

### Nets
+5V: P2.1
+12V: D2.1(A) P2.3
GND: D3.1(A) D43.1(A) J1.A1 J2.A1 P3.A2 P5.A2 R70.1 ; sheet RL/GND, sheet RL/GND, sheet RL/GND, sheet RL/GND, sheet RL/GND, sheet RL/GND
NEO_VCC: D38.A D43.2(K) FUSE1.2 J1.A3 J2.A3 P5.A1
RELAY_VCC: D3.2(K) FUSE2.2 P21.A1 P26.A1 P27.A1 P28.A1 P29.A1 P35.A1 ; sheet RL/VOH, sheet RL/RELAY_VCC, sheet RL/VOH, sheet RL/RELAY_VCC, sheet RL/VOH, sheet RL/RELAY_VCC, sheet RL/VOH, sheet RL/RELAY_VCC, sheet RL/VOH, sheet RL/RELAY_VCC, sheet RL/VOH, sheet RL/RELAY_VCC
AUX0_RLY: P26.A2 ; sheet RL/VOn
AUX1_RLY: P27.A2 ; sheet RL/VOn
AUX2_RLY: P28.A2 ; sheet RL/VOn
AUX3_RLY: P29.A2 ; sheet RL/VOn
AUXOUT0_ISO: port AUX0, sheet RL/CONTROL_5V
AUXOUT1_ISO: port AUX1, sheet RL/CONTROL_5V
AUXOUT2_ISO: port AUX2, sheet RL/CONTROL_5V
AUXOUT3_ISO: port AUX3, sheet RL/CONTROL_5V
COOLANT_ISO: port COOLANT, sheet RL/CONTROL_5V
COOLANTn: P35.A2 ; sheet RL/VOn
FASTO0_ISO: R1.1 ; port NEO1
FASTO1_ISO: R18.1 ; port NEO2
MIST_ISO: port MIST, sheet RL/CONTROL_5V
MISTn: P21.A2 ; sheet RL/VOn
NEOPIXEL1_5V: J1.A2 R1.2
NEOPIXEL2_5V: J2.A2 R18.2
NetD2_2: D2.2(K) FUSE2.1 P3.A1
NetD38_K: D38.K R70.2
NetFUSE1_1: FUSE1.1 P2.2

### Notes on the sheet
- AUX Outputs
- SHEET
- Expatria Technologies
- 1136 Glade Court
- Port Coquitlam, BC V3B 1R5
- PROJECT
- SIZE
- ENGR
- MODIFIED
- DOCUMENT
- REV
- Copyright Expatria Technologies 2023. This document describes Open Hardware and is licensed under the CERN-OHL-S v2. No warranty is implied or expressed.
- EMAIL: INFO@EXPATRIA.CA
- B
- /

### Library data of the parts
D2 = SSB43L-E3_52T: Rectifier Diode Schottky 30V 4A 2-Pin SMB T/R / DIODE SCHOTTKY 30V 4A DO214AA; Manufacturer_Name: Vishay; Manufacturer_Part_Number: SSB43L-E3/52T; Manufacturer: Vishay Semiconductors; Forward Voltage: 450mV; Max Reverse Current: 600uA; Peak Non-Repetitive Surge Current: 100A; Element Configuration: Single; Polarity: Standard; Value: SSB43L-E3/52T; ComponentLink1Description: https://datasheet.ciiva.com/4245/ssb43l-4245635.pdf?src-supplier=Arrow+Electronics; ComponentLink1URL: https://datasheet.ciiva.com/4245/ssb43l-4245635.pdf?src-supplier=Arrow+Electronics; Supplier: LCSC; SuppliersPartNumber: C222519; Datasheet Link: https://componentsearchengine.com/Datasheets/2/SSB43L-E3_52T.pdf; Height: 2.44mm; Supplier 1: LCSC; Supplier Part Number 1: C222519; Manufacturer Part Number: SSB43L-E3/52T; RoHS: Yes; Category: Rectifier Diodes; Stock 1: 283; Pricing 1: 1=0.35480, 10=0.28480, 30=0.25460, 100=0.21800, 750=0.20210, 1500=0.19100 (USD); Mount: Surface Mount; Case/Package: DO-214AA; Number of Pins: 2; Contact Plating: Tin,Matte; Min Operating Temperature: -65°C; Max Operating Temperature: 150°C; Packaging: Tape and Reel; Forward Current: 4A; Package Quantity: 1; Average Rectified Current: 4A; Max Repetitive Reverse Voltage (Vrrm): 30V; Max Forward Surge Current (Ifsm): 100A; Max Reverse Voltage (DC): 30V; Max Surge Current: 100A; Max Reverse Leakage Current: 600uA; Voltage Rating (DC): 30V; Current Rating: 4A; Output Current: 4A; Length: 4.7mm; Width: 3.8mm; Radiation Hardening: No; Lead Free: Lead Free; RoHS Compliant: Yes; ComponentLink2URL: https://datasheet.ciiva.com/15224/getdatasheetpartid-99263-15224680.pdf?src-supplier=Verical; ComponentLink2Description: https://datasheet.ciiva.com/15224/getdatasheetpartid-99263-15224680.pdf?src-supplier=Verical; ComponentLink3URL: https://datasheet.ciiva.com/14634/0900766b80dd0508-14634162.pdf?src-supplier=Allied+Electronics; ComponentLink3Description: https://datasheet.ciiva.com/14634/0900766b80dd0508-14634162.pdf?src-supplier=Allied+Electronics; ComponentLink4URL: https://datasheet.ciiva.com/7962/64541-7962449.pdf?src-supplier=Element14; ComponentLink4Description: https://datasheet.ciiva.com/7962/64541-7962449.pdf?src-supplier=Element14; ComponentLink5URL: https://datasheet.ciiva.com/18434/70217334-18434422.pdf?src-supplier=Allied+Electronics; ComponentLink5Description: https://datasheet.ciiva.com/18434/70217334-18434422.pdf?src-supplier=Allied+Electronics
D3 D43 = BZT52C27: 27V ±5% 1W 500nA @ 20.5V SMA(DO-214AC) Zener Diodes RoHS; ComponentLink1Description: 供应商链接; ComponentLink1URL: http://www.szlcsc.com/product/details_8541.html; Supplier: LC
  D3: Package: SMA(DO-214AC); SuppliersPartNumber: C155318
  D43: Package: SMAF; SuppliersPartNumber: C169539
D38 = 0603 LED Green: LED; ComponentLink1Description: 供应商链接; ComponentLink1URL: http://www.szlcsc.com/product/details_73152.html; Package: 0603; Supplier: LC; SuppliersPartNumber: C72043; Color: Green
FUSE1 FUSE2 = JK-nSMD050-24: 24V 1A 0.1s 1206 PTC Resettable Fuses RoHS; Manufacturer: Jinrui Electronic Materials Co.; Package: 1206; Supplier: LC; SuppliersPartNumber: C369160; PartNumber: JK-nSMD050-24
J1 J2 = 3.5mm Terminal Header 3p: as J3 on sheet Photocoupler12Vinput; PartNumber: WJ15EDGVC-3.5-3P; PackageReference: SL_3_50_180G_03; ComponentLink1URL: http://www.weidmueller.com/; ComponentLink1Description: Manufacturer URL; Packaging: Box; Revision: V1; SuppliersPartNumber: C192778; Manufacturer 1: Ningbo Kangnex Elec; Manufacturer Part Number 1: WJ15EDGVC-3.5-3P; Package: P=3.5mm
P2 = Header 3: Header, 3-Pin; Publisher: Altium Limited; SuppliersPartNumber: C49257
P3 P5 P21 P26-P29 P35 = 3.5mm Terminal Header 2p: Header,Male Pin,Covered(4 Sided) 2 1 0.138"（3.50mm） 2 P=3.5mm Pluggable System Terminal Block RoHS; Manufacturer: Weidmueller; Manufacturer 1: Weidmuller; Manufacturer Part Number 1: 1604470000; UL_94_flammability_rating: V-0; Pitch_mm: 3.5 mm; Side_termination_characteristic: closed side; Pitch_inch: 0.138 inch; Solder_pin_length_mm: 3.2 mm; Short_text_for_material: SL 3.50/02/180G 3.2SN OR BX; ComponentLink1Description: Manufacturer URL; ComponentLink1URL: http://www.weidmueller.com/; PartNumber: WJ15EDGVC-3.5-2P; Revision: V1; PackageReference: SL_3_50_180G_02; Packaging: Box; SuppliersPartNumber: C192777
R1 R18 = 0603 100R (1000) 1%: Chip resistor; Manufacturer: Uniroyal Elec; PartNumber: 0603WAF1000T5E; Power: 1/10W; ComponentLink1Description: Supplier link; ComponentLink1URL: http://www.szlcsc.com/product/details_23502.html; Package: 0603; Supplier: LC; SuppliersPartNumber: C22775; Resistance: 100Ω; Tolerance: 1%
R70 = 0603 10K (1002) 1%: as R2 on sheet Spindle_Control; ComponentLink1Description: Supplier link; ComponentLink1URL: http://www.szlcsc.com/product/details_26547.html; Package: 0603; Supplier: LC; SuppliersPartNumber: C25804; Resistance: 10KΩ; Tolerance: 1%

## Sheet Relay_Driver.SchDoc: FlexiHAL-STP
size B
Used 6 times, as channels Mezzanine Board/AUX_O/RL, Mezzanine Board/AUX_O/RL, Mezzanine Board/AUX_O/RL, Mezzanine Board/AUX_O/RL, Mezzanine Board/AUX_O/RL, Mezzanine Board/AUX_O/RL. Parts and nets are listed once, with the designators drawn on the sheet.
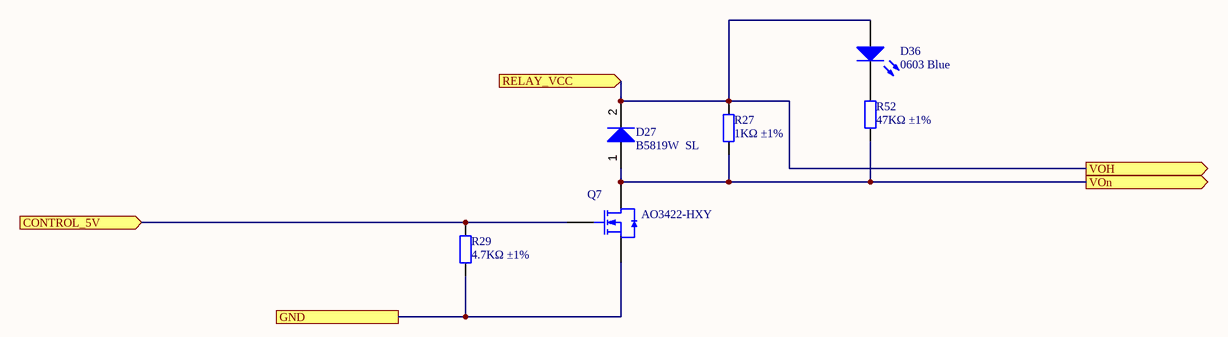
[diagram p7: Relay_Driver.SchDoc]

### Parts
D27  B5819W  SL  [SOD-123]
D36  0603 Blue  [0603_LED_S1]
Q7  AO3422-HXY  [SOT-23-3L]
R27  1KΩ ±1%  [0603_R]
R29  4.7KΩ ±1%  [0603_R]
R52  47KΩ ±1%  [0603_R]

### Ports
CONTROL_5V (in), GND, RELAY_VCC (in), VOH (out), VOn (out)

### Nets
CONTROL_5V: Q7.1(G) R29.2 ; port CONTROL_5V
GND: Q7.2(S) R29.1 ; port GND
RELAY_VCC: D27.2(K) D36.A R27.2 ; port RELAY_VCC, port VOH
VOn: D27.1(A) Q7.3(D) R27.1 R52.1 ; port VOn
NetD36_K: D36.K R52.2

### Channels
Mezzanine Board/AUX_O/RL: designators end in _Mezzanine_Board_AUX_O_RL#1; ports CONTROL_5V=AUXOUT3_ISO GND=GND RELAY_VCC=RELAY_VCC VOH=RELAY_VCC VOn=AUX3_RLY
Mezzanine Board/AUX_O/RL: designators end in _Mezzanine_Board_AUX_O_RL#2; ports CONTROL_5V=AUXOUT2_ISO GND=GND RELAY_VCC=RELAY_VCC VOH=RELAY_VCC VOn=AUX2_RLY
Mezzanine Board/AUX_O/RL: designators end in _Mezzanine_Board_AUX_O_RL#3; ports CONTROL_5V=AUXOUT1_ISO GND=GND RELAY_VCC=RELAY_VCC VOH=RELAY_VCC VOn=AUX1_RLY
Mezzanine Board/AUX_O/RL: designators end in _Mezzanine_Board_AUX_O_RL#4; ports CONTROL_5V=AUXOUT0_ISO GND=GND RELAY_VCC=RELAY_VCC VOH=RELAY_VCC VOn=AUX0_RLY
Mezzanine Board/AUX_O/RL: designators end in _Mezzanine_Board_AUX_O_RL#5; ports CONTROL_5V=COOLANT_ISO GND=GND RELAY_VCC=RELAY_VCC VOH=RELAY_VCC VOn=COOLANTn
Mezzanine Board/AUX_O/RL: designators end in _Mezzanine_Board_AUX_O_RL#6; ports CONTROL_5V=MIST_ISO GND=GND RELAY_VCC=RELAY_VCC VOH=RELAY_VCC VOn=MISTn

### Notes on the sheet
- SHEET
- Expatria Technologies
- 1136 Glade Court
- Port Coquitlam, BC V3B 1R5
- PROJECT
- SIZE
- ENGR
- MODIFIED
- DOCUMENT
- REV
- Copyright Expatria Technologies 2023. This document describes Open Hardware and is licensed under the CERN-OHL-S v2. No warranty is implied or expressed.
- EMAIL: INFO@EXPATRIA.CA
- B
- /

### Library data of the parts
D27 = SOD-123 B5819W  SL: Schottky Diode; ComponentLink1Description: 供应商链接; ComponentLink1URL: http://www.szlcsc.com/product/details_9093.html; Package: SOD-123; Supplier: LC; SuppliersPartNumber: C8598
D36 = 0603 LED Blue: LED; ComponentLink1Description: 供应商链接; ComponentLink1URL: http://www.szlcsc.com/product/details_73150.html; Package: 0603; Supplier: LC; SuppliersPartNumber: C72041; Color: Blue
Q7 = AO3400A N道沟 X0YV1T SOT-23: as Q16 on sheet Spindle_Control; ComponentLink1Description: 供应商链接; ComponentLink1URL: http://www.szlcsc.com/product/details_21629.html; Package: SOT-23L; Supplier: LC; SuppliersPartNumber: C4748727
R27 = 0603 1K (1001) 1%: as R12 on sheet Spindle_Control; ComponentLink1Description: Supplier link; ComponentLink1URL: http://www.szlcsc.com/product/details_21904.html; Package: 0603; Supplier: LC; SuppliersPartNumber: C21190; Resistance: 1KΩ; Tolerance: 1%
R29 = 0603 4.7K (4701) 1%: as R6 on sheet Limit_Switches; ComponentLink1Description: Supplier link; ComponentLink1URL: http://www.szlcsc.com/product/details_23889.html; Package: 0603; Supplier: LC; SuppliersPartNumber: C23162; Resistance: 4.7KΩ; Tolerance: 1%
R52 = 0603 47K (4702) 1%: as R38 on sheet Spindle_Control; ComponentLink1Description: Supplier link; ComponentLink1URL: http://www.szlcsc.com/product/details_26562.html; Package: 0603; Supplier: LC; SuppliersPartNumber: C25819; Resistance: 47KΩ; Tolerance: 1%

## Sheet Aux_Inputs.SchDoc: RP2040 CNC
size B; Author: AM; CompanyName: Expatria Technologies; DrawnBy: A.Marles; Engineer: AM; Organization: Expatria Technolgoies; DocumentNumber: 7; Revision: A1; SheetNumber: 7; SheetTotal: 14
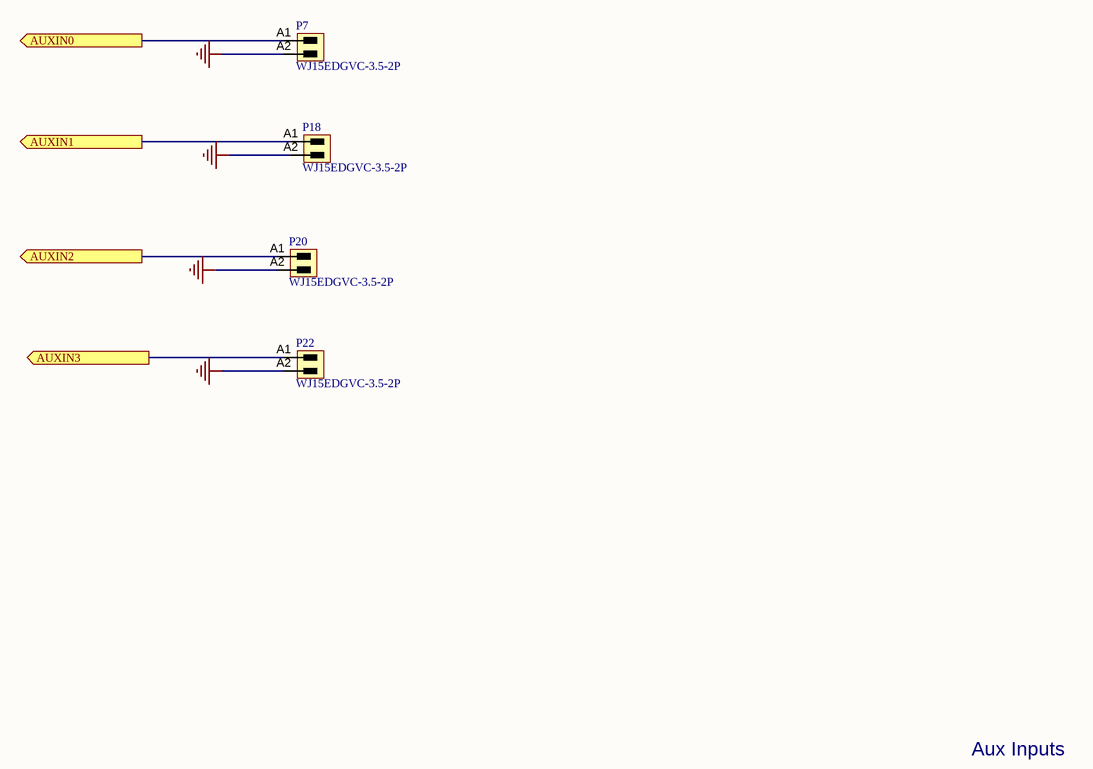
[diagram p8: Aux_Inputs.SchDoc]

### Parts
P7  WJ15EDGVC-3.5-2P  [691321100002]
P18  WJ15EDGVC-3.5-2P  [691321100002]
P20  WJ15EDGVC-3.5-2P  [691321100002]
P22  WJ15EDGVC-3.5-2P  [691321100002]

### Ports
AUXIN0 (out), AUXIN1 (out), AUXIN2 (out), AUXIN3 (out)

### Nets
GND: P7.A2 P18.A2 P20.A2 P22.A2
AUXIN0_ISO: P7.A1 ; port AUXIN0
AUXIN1_ISO: P18.A1 ; port AUXIN1
AUXIN2_ISO: P20.A1 ; port AUXIN2
AUXIN3_ISO: P22.A1 ; port AUXIN3

### Notes on the sheet
- Aux Inputs
- SHEET
- Expatria Technologies
- 1136 Glade Court
- Port Coquitlam, BC V3B 1R5
- PROJECT
- SIZE
- ENGR
- MODIFIED
- DOCUMENT
- REV
- Copyright Expatria Technologies 2022. This document describes Open Hardware and is licensed under the CERN-OHL-S v2. No warranty is implied or expressed.
- EMAIL: INFO@EXPATRIA.CA
- B
- /

### Library data of the parts
P7 P18 P20 P22 = 3.5mm Terminal Header 2p: as P3 on sheet Aux_Outputs; ComponentLink1Description: Manufacturer URL; ComponentLink1URL: http://www.weidmueller.com/; PartNumber: WJ15EDGVC-3.5-2P; Revision: V1; PackageReference: SL_3_50_180G_02; Packaging: Box; SuppliersPartNumber: C192777

## Nets that join several sheets
+5V: FLEXI_HAL_Quark_Mezz (P1.10), Spindle_Control (P6.1 R23.1), Aux_Outputs (P2.1)
+12V: FLEXI_HAL_Quark_Mezz (12 pins), Limit_Switches (7 pins), Mezzanine Board/LIM_SW/XL (J3_XL.A1), Mezzanine Board/LIM_SW/YL (J3_YL.A1), Mezzanine Board/LIM_SW/ZL (J3_ZL.A1), Mezzanine Board/LIM_SW/AL (J3_AL.A1), Mezzanine Board/LIM_SW/BL (J3_BL.A1), Mezzanine Board/LIM_SW/CL (J3_CL.A1), Misc_switches (5 pins), Mezzanine Board/USR_SW/UD (J3_UD.A1), Mezzanine Board/USR_SW/UP (J3_UP.A1), Mezzanine Board/USR_SW/UR (J3_UR.A1), Mezzanine Board/USR_SW/UH (J3_UH.A1), Mezzanine Board/USR_SW/UT (J3_UT.A1), Spindle_Control (D39.A P6.3), Aux_Outputs (D2.1 P2.3)
GND: FLEXI_HAL_Quark_Mezz (10 pins), Limit_Switches (J4.2), Mezzanine Board/LIM_SW/XL (J3_XL.A3), Mezzanine Board/LIM_SW/YL (J3_YL.A3), Mezzanine Board/LIM_SW/ZL (J3_ZL.A3), Mezzanine Board/LIM_SW/AL (J3_AL.A3), Mezzanine Board/LIM_SW/BL (J3_BL.A3), Mezzanine Board/LIM_SW/CL (J3_CL.A3), Mezzanine Board/USR_SW/UD (J3_UD.A3), Mezzanine Board/USR_SW/UP (J3_UP.A3), Mezzanine Board/USR_SW/UR (J3_UR.A3), Mezzanine Board/USR_SW/UH (J3_UH.A3), Mezzanine Board/USR_SW/UT (J3_UT.A3), Spindle_Control (6 pins), Aux_Outputs (7 pins), Mezzanine Board/AUX_O/RL (Q7_Mezzanine_Board_AUX_O_RL#1.2 R29_Mezzanine_Board_AUX_O_RL#1.1), Mezzanine Board/AUX_O/RL (Q7_Mezzanine_Board_AUX_O_RL#2.2 R29_Mezzanine_Board_AUX_O_RL#2.1), Mezzanine Board/AUX_O/RL (Q7_Mezzanine_Board_AUX_O_RL#3.2 R29_Mezzanine_Board_AUX_O_RL#3.1), Mezzanine Board/AUX_O/RL (Q7_Mezzanine_Board_AUX_O_RL#4.2 R29_Mezzanine_Board_AUX_O_RL#4.1), Mezzanine Board/AUX_O/RL (Q7_Mezzanine_Board_AUX_O_RL#5.2 R29_Mezzanine_Board_AUX_O_RL#5.1), Mezzanine Board/AUX_O/RL (Q7_Mezzanine_Board_AUX_O_RL#6.2 R29_Mezzanine_Board_AUX_O_RL#6.1), Aux_Inputs (P7.A2 P18.A2 P20.A2 P22.A2)
RELAY_VCC: Spindle_Control (D23.2 P13.A1), Aux_Outputs (8 pins), Mezzanine Board/AUX_O/RL (D27_Mezzanine_Board_AUX_O_RL#1.2 D36_Mezzanine_Board_AUX_O_RL#1.A R27_Mezzanine_Board_AUX_O_RL#1.2), Mezzanine Board/AUX_O/RL (D27_Mezzanine_Board_AUX_O_RL#2.2 D36_Mezzanine_Board_AUX_O_RL#2.A R27_Mezzanine_Board_AUX_O_RL#2.2), Mezzanine Board/AUX_O/RL (D27_Mezzanine_Board_AUX_O_RL#3.2 D36_Mezzanine_Board_AUX_O_RL#3.A R27_Mezzanine_Board_AUX_O_RL#3.2), Mezzanine Board/AUX_O/RL (D27_Mezzanine_Board_AUX_O_RL#4.2 D36_Mezzanine_Board_AUX_O_RL#4.A R27_Mezzanine_Board_AUX_O_RL#4.2), Mezzanine Board/AUX_O/RL (D27_Mezzanine_Board_AUX_O_RL#5.2 D36_Mezzanine_Board_AUX_O_RL#5.A R27_Mezzanine_Board_AUX_O_RL#5.2), Mezzanine Board/AUX_O/RL (D27_Mezzanine_Board_AUX_O_RL#6.2 D36_Mezzanine_Board_AUX_O_RL#6.A R27_Mezzanine_Board_AUX_O_RL#6.2)
ALIM_EXT_n: FLEXI_HAL_Quark_Mezz (P1.23), Limit_Switches (R19.2), Mezzanine Board/LIM_SW/AL (J3_AL.A2)
AUX0_RLY: Aux_Outputs (P26.A2), Mezzanine Board/AUX_O/RL (D27_Mezzanine_Board_AUX_O_RL#4.1 Q7_Mezzanine_Board_AUX_O_RL#4.3 R27_Mezzanine_Board_AUX_O_RL#4.1 R52_Mezzanine_Board_AUX_O_RL#4.1)
AUX1_RLY: Aux_Outputs (P27.A2), Mezzanine Board/AUX_O/RL (D27_Mezzanine_Board_AUX_O_RL#3.1 Q7_Mezzanine_Board_AUX_O_RL#3.3 R27_Mezzanine_Board_AUX_O_RL#3.1 R52_Mezzanine_Board_AUX_O_RL#3.1)
AUX2_RLY: Aux_Outputs (P28.A2), Mezzanine Board/AUX_O/RL (D27_Mezzanine_Board_AUX_O_RL#2.1 Q7_Mezzanine_Board_AUX_O_RL#2.3 R27_Mezzanine_Board_AUX_O_RL#2.1 R52_Mezzanine_Board_AUX_O_RL#2.1)
AUX3_RLY: Aux_Outputs (P29.A2), Mezzanine Board/AUX_O/RL (D27_Mezzanine_Board_AUX_O_RL#1.1 Q7_Mezzanine_Board_AUX_O_RL#1.3 R27_Mezzanine_Board_AUX_O_RL#1.1 R52_Mezzanine_Board_AUX_O_RL#1.1)
AUXIN0_ISO: FLEXI_HAL_Quark_Mezz (P1.33), Aux_Inputs (P7.A1)
AUXIN1_ISO: FLEXI_HAL_Quark_Mezz (P1.35), Aux_Inputs (P18.A1)
AUXIN2_ISO: FLEXI_HAL_Quark_Mezz (P1.37), Aux_Inputs (P20.A1)
AUXIN3_ISO: FLEXI_HAL_Quark_Mezz (P1.39), Aux_Inputs (P22.A1)
AUXOUT0_ISO: FLEXI_HAL_Quark_Mezz (P1.41), Mezzanine Board/AUX_O/RL (Q7_Mezzanine_Board_AUX_O_RL#4.1 R29_Mezzanine_Board_AUX_O_RL#4.2)
AUXOUT1_ISO: FLEXI_HAL_Quark_Mezz (P1.43), Mezzanine Board/AUX_O/RL (Q7_Mezzanine_Board_AUX_O_RL#3.1 R29_Mezzanine_Board_AUX_O_RL#3.2)
AUXOUT2_ISO: FLEXI_HAL_Quark_Mezz (P1.45), Mezzanine Board/AUX_O/RL (Q7_Mezzanine_Board_AUX_O_RL#2.1 R29_Mezzanine_Board_AUX_O_RL#2.2)
AUXOUT3_ISO: FLEXI_HAL_Quark_Mezz (P1.47), Mezzanine Board/AUX_O/RL (Q7_Mezzanine_Board_AUX_O_RL#1.1 R29_Mezzanine_Board_AUX_O_RL#1.2)
BLIM_EXT_n: FLEXI_HAL_Quark_Mezz (P1.27), Limit_Switches (R24.2), Mezzanine Board/LIM_SW/BL (J3_BL.A2)
CLIM_EXT_n: FLEXI_HAL_Quark_Mezz (P1.31), Limit_Switches (R25.2), Mezzanine Board/LIM_SW/CL (J3_CL.A2)
COOLANT_ISO: FLEXI_HAL_Quark_Mezz (P1.60), Mezzanine Board/AUX_O/RL (Q7_Mezzanine_Board_AUX_O_RL#5.1 R29_Mezzanine_Board_AUX_O_RL#5.2)
COOLANTn: Aux_Outputs (P35.A2), Mezzanine Board/AUX_O/RL (D27_Mezzanine_Board_AUX_O_RL#5.1 Q7_Mezzanine_Board_AUX_O_RL#5.3 R27_Mezzanine_Board_AUX_O_RL#5.1 R52_Mezzanine_Board_AUX_O_RL#5.1)
DOOR_EXT_n: FLEXI_HAL_Quark_Mezz (P1.16), Misc_switches (R74.2), Mezzanine Board/USR_SW/UD (J3_UD.A2)
FASTO0_ISO: FLEXI_HAL_Quark_Mezz (P1.49), Aux_Outputs (R1.1)
FASTO1_ISO: FLEXI_HAL_Quark_Mezz (P1.51), Aux_Outputs (R18.1)
HOLD_EXT_n: FLEXI_HAL_Quark_Mezz (P1.20), Misc_switches (R14.2), Mezzanine Board/USR_SW/UH (J3_UH.A2)
MIST_ISO: FLEXI_HAL_Quark_Mezz (P1.58), Mezzanine Board/AUX_O/RL (Q7_Mezzanine_Board_AUX_O_RL#6.1 R29_Mezzanine_Board_AUX_O_RL#6.2)
MISTn: Aux_Outputs (P21.A2), Mezzanine Board/AUX_O/RL (D27_Mezzanine_Board_AUX_O_RL#6.1 Q7_Mezzanine_Board_AUX_O_RL#6.3 R27_Mezzanine_Board_AUX_O_RL#6.1 R52_Mezzanine_Board_AUX_O_RL#6.1)
PROBE_EXT_n: FLEXI_HAL_Quark_Mezz (P1.24), Limit_Switches (J4.8), Misc_switches (R10.2), Mezzanine Board/USR_SW/UP (J3_UP.A2)
RUN_EXT_n: FLEXI_HAL_Quark_Mezz (P1.32), Misc_switches (R11.2), Mezzanine Board/USR_SW/UR (J3_UR.A2)
SPINDLE_DIR_ISO: FLEXI_HAL_Quark_Mezz (P1.59), Spindle_Control (R35.1)
SPINDLE_EN_ISO: FLEXI_HAL_Quark_Mezz (P1.57), Spindle_Control (Q1.1 Q16.1 R37.1)
SPINDLE_PWM_ISO: FLEXI_HAL_Quark_Mezz (P1.55), Spindle_Control (R9.1)
TOOL_EXT_n: FLEXI_HAL_Quark_Mezz (P1.28), Limit_Switches (J4.7), Misc_switches (R17.2), Mezzanine Board/USR_SW/UT (J3_UT.A2)
XLIM_EXT_n: FLEXI_HAL_Quark_Mezz (P1.11), Limit_Switches (R6.2), Mezzanine Board/LIM_SW/XL (J3_XL.A2)
YLIM_EXT_n: FLEXI_HAL_Quark_Mezz (P1.15), Limit_Switches (R15.2), Mezzanine Board/LIM_SW/YL (J3_YL.A2)
ZLIM_EXT_n: FLEXI_HAL_Quark_Mezz (P1.19), Limit_Switches (R16.2), Mezzanine Board/LIM_SW/ZL (J3_ZL.A2)

## Assembly variants
SMT_ONLY: not fitted A1 J1_LS_A J1_LS_X J1_LS_Y J1_LS_Z J2_LS_A J2_LS_X J2_LS_Y J2_LS_Z J3_PH_CY J3_PH_CY J3_PH_FD J3_PH_HLT J3_PH_PR J4 J6 J6 J7 J8 J8 J9 P1 P2 P2 P3 P3 P4 P4 P5 P5 P6 P6 P7 P7 P8 P9 P9 P10 P10 P11 P11 P12 P12 P13 P13 P14 P14 P16 P16 P17 P18 P19 P19 P20 P20 P21 P21 P22 P22 P23 P23 P24 P24 P25 P25 P26 P27 P28 P29 R? U30
FULL_PLACE: not fitted P1 P8 P8 P18 P18 P20 R43 R44 R134 R? R? R? U30